# EAGLE design untitled (EAGLE 7.2.0)
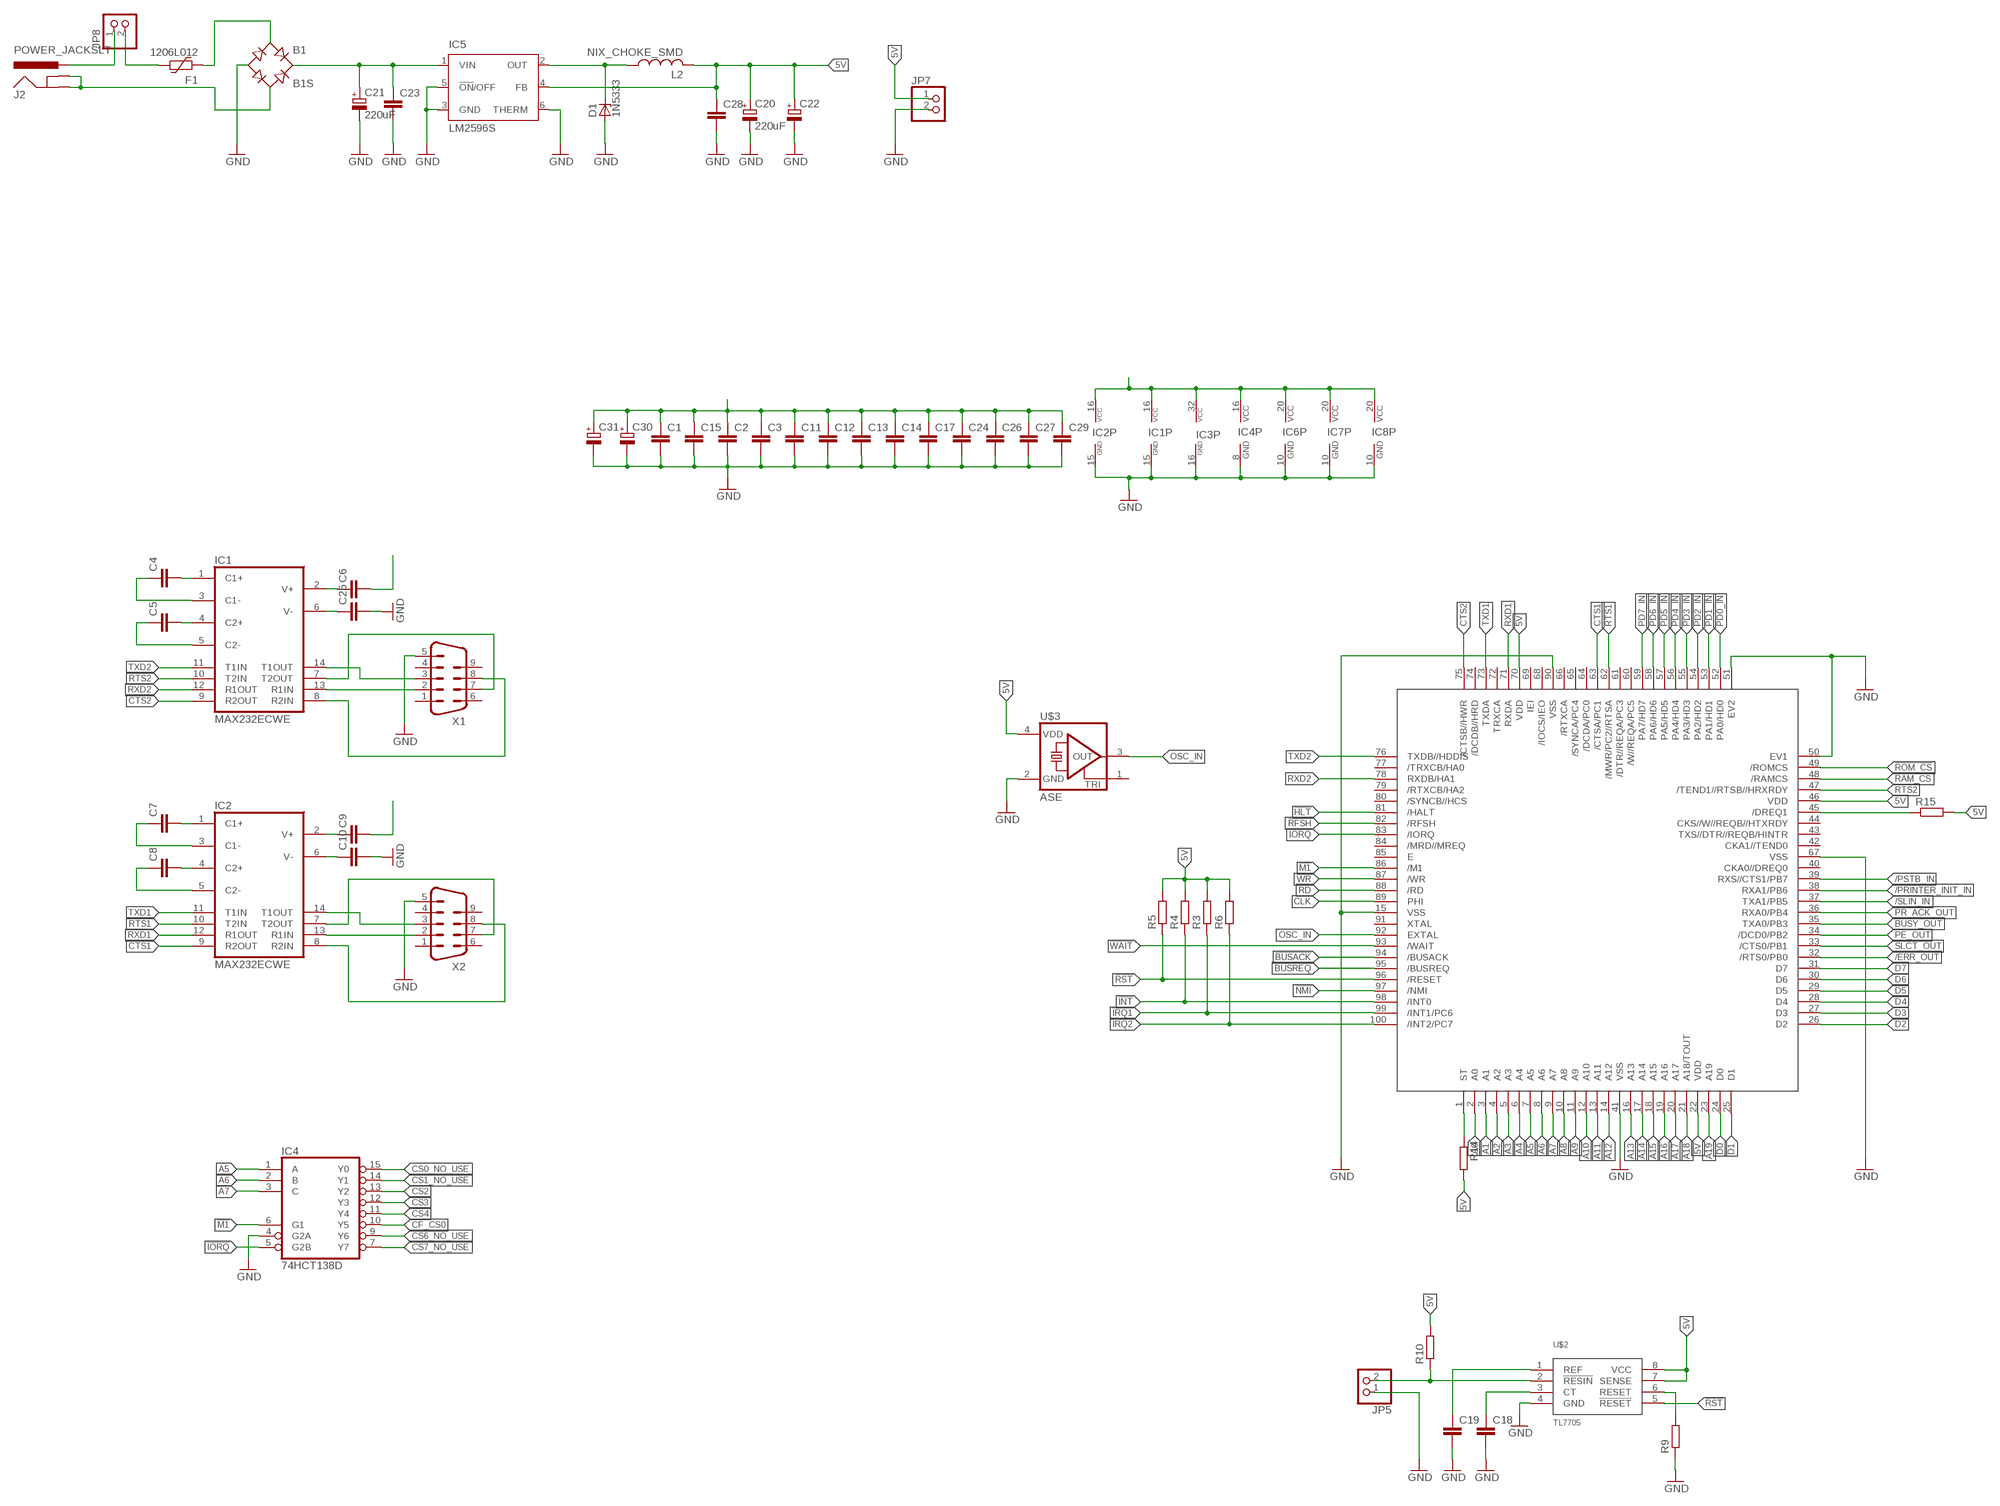
[diagram p0: schematic, sheet 1, part 1 of 2]
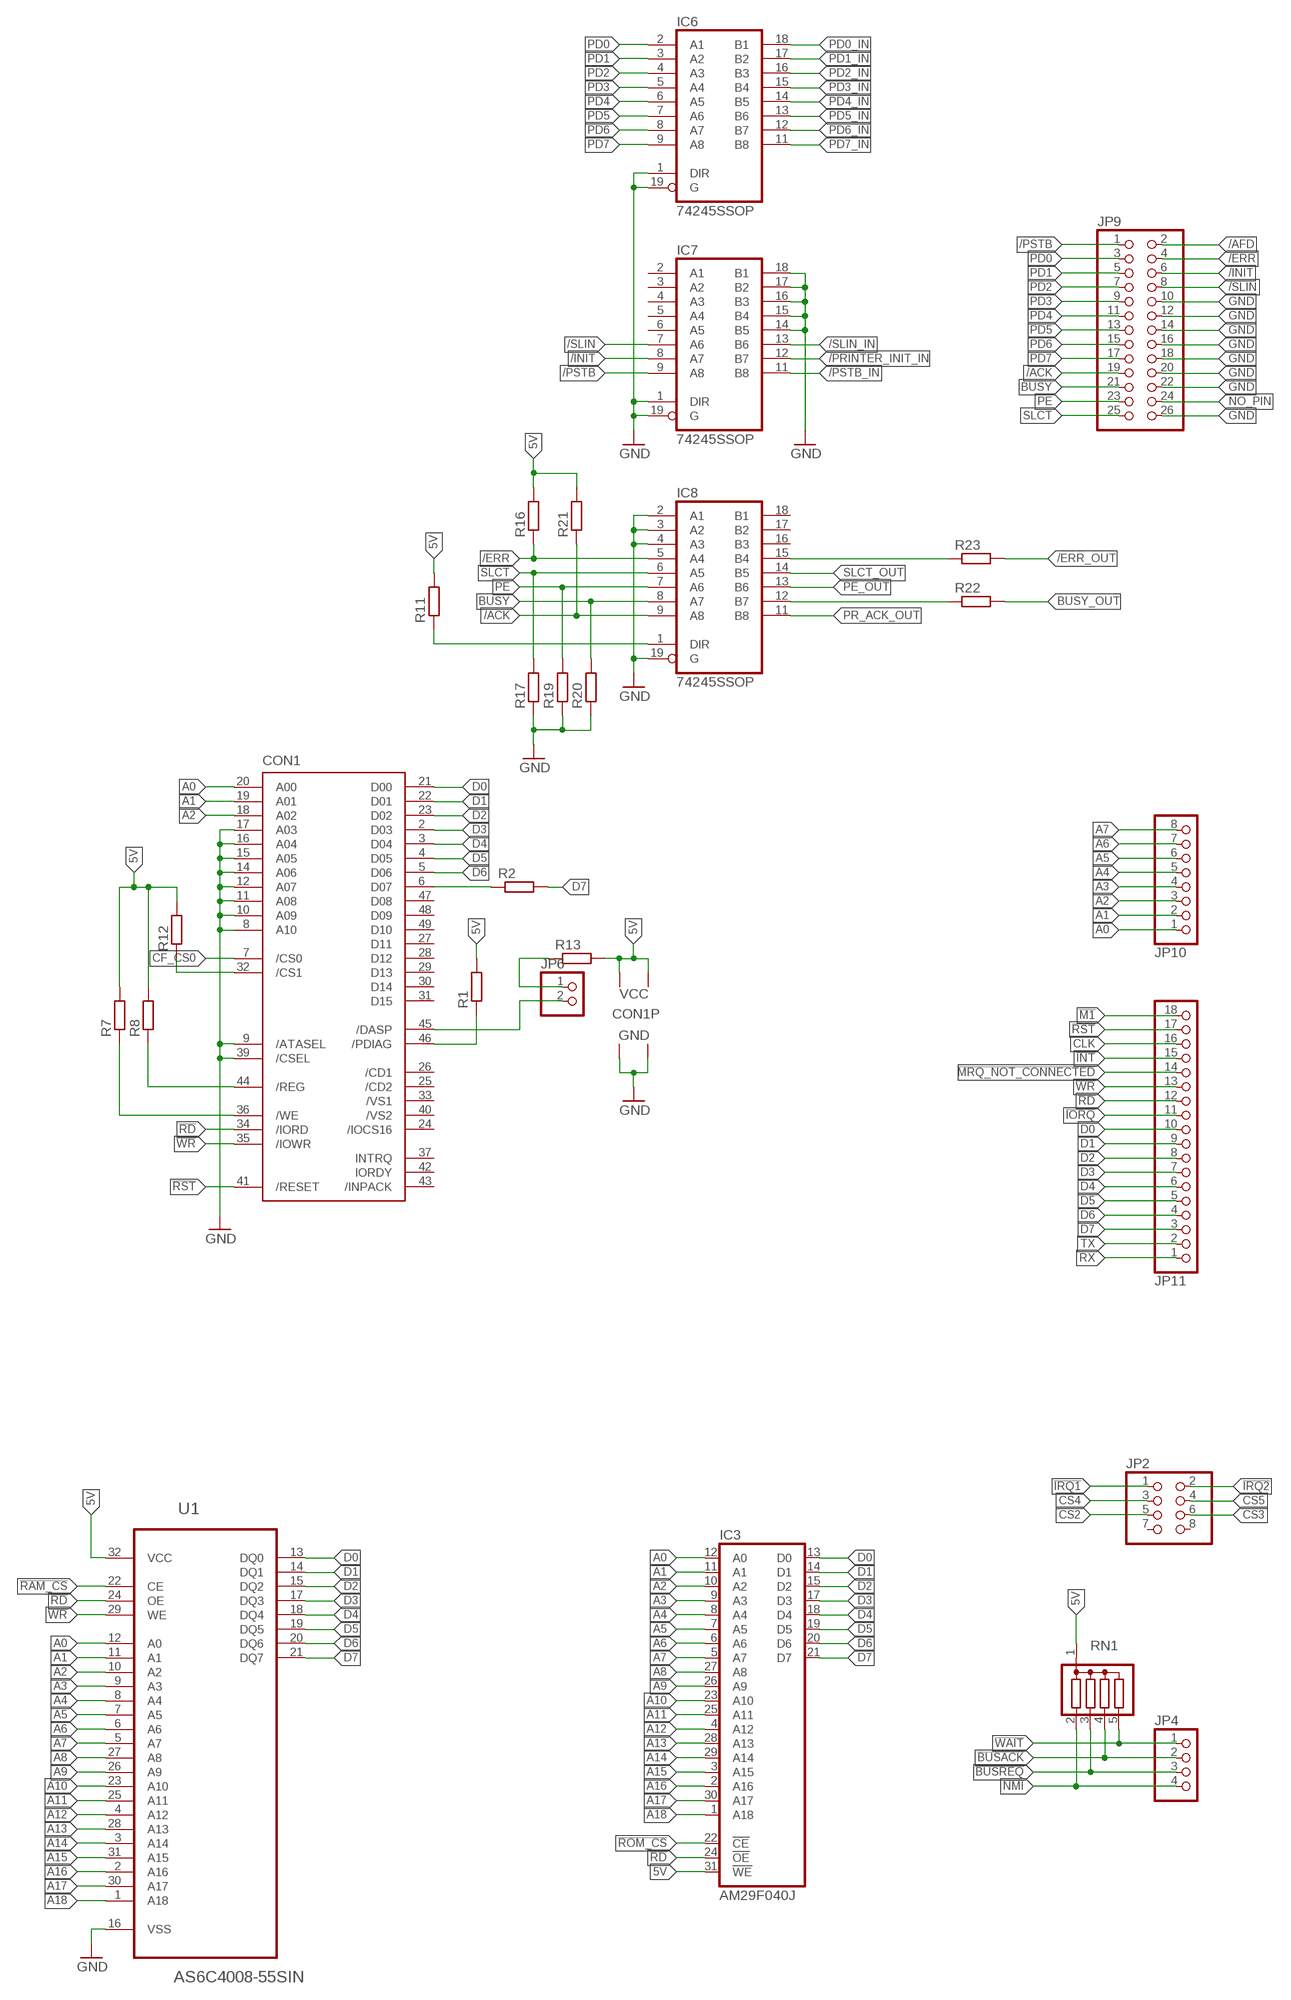
[diagram p1: schematic, sheet 1, part 2 of 2]

## Parts
B1  B1S  [MBS]
C1  C-EUC0603  [C0603]
C2  C-EUC0603  [C0603]
C3  C-EUC0402  [C0402]
C4  C-EUC0603  [C0603]
C5  C-EUC0603  [C0603]
C6  C-EUC0603  [C0603]
C7  C-EUC0603  [C0603]
C8  C-EUC0603  [C0603]
C9  C-EUC0603  [C0603]
C10  C-EUC0603  [C0603]
C11  C-EUC0603  [C0603]
C12  C-EUC0603  [C0603]
C13  C-EUC0402  [C0402]
C14  C-EUC0603  [C0603]
C15  C-EUC0603  [C0603]
C17  C-EUC0603  [C0603]
C18  C-EUC0603  [C0603]
C19  C-EUC0603  [C0603]
C20  220uF  CPOL-EU153CLV-0810  [153CLV-0810]
C21  220uF  CPOL-EU153CLV-0810  [153CLV-0810]
C22  CPOL-EUSMCC  [SMC_C]
C23  C-EUC0603  [C0603]
C24  C-EUC0603  [C0603]
C25  C-EUC0603  [C0603]
C26  C-EUC0402  [C0402]
C27  C-EUC0402  [C0402]
C28  C-EUC0603  [C0603]
C29  C-EUC0603  [C0603]
C30  CPOL-EUSMCB  [SMC_B]
C31  CPOL-EUSMCB  [SMC_B]
CON1  CF-CARD-IDE_MODE  [MI20-50PD-SF]
D1  1N5333  [C1702-15]
F1  1206L012  [1206L]
IC1  MAX232ECWE  [SO16L]
IC2  MAX232ECWE  [SO16L]
IC3  AM29F040J  [PLCC32R]
IC4  74HCT138D  [SO16]
IC5  LM2596S  [TO263-5]
IC6  74245SSOP  [SSOP20]
IC7  74245SSOP  [SSOP20]
IC8  74245SSOP  [SSOP20]
J2  POWER_JACKSLT  [POWER_JACK_SLOT]
JP2  PINHD-2X4  [2X04]
JP4  PINHD-1X4  [1X04]
JP5  PINHD-1X2  [1X02]
JP6  PINHD-1X2  [1X02]
JP7  PINHD-1X2  [1X02]
JP8  PINHD-1X2  [1X02]
JP9  PINHD-2X13_2.54-SMD  [2X13SMD]
JP10  PINHD-1X8  [1X08]
JP11  PINHD-1X18  [1X18]
L2  NIX_CHOKE_SMD  [NIX_CHOKE_SMD]
R1  R-EU_R0603  [R0603]
R2  R-EU_R0603  [R0603]
R3  R-EU_R0402  [R0402]
R4  R-EU_R0603  [R0603]
R5  R-EU_R1206  [R1206]
R6  R-EU_R0603  [R0603]
R7  R-EU_R0603  [R0603]
R8  R-EU_R0603  [R0603]
R9  R-EU_R0603  [R0603]
R10  R-EU_M1206  [M1206]
R11  R-EU_R0603  [R0603]
R12  R-EU_R0603  [R0603]
R13  R-EU_R0603  [R0603]
R14  R-EU_0204/5  [0204/5]
R15  R-EU_R0402  [R0402]
R16  R-EU_R0603  [R0603]
R17  R-EU_R0603  [R0603]
R19  R-EU_R0603  [R0603]
R20  R-EU_R0603  [R0603]
R21  R-EU_R0603  [R0603]
R22  R-EU_R0402  [R0402]
R23  R-EU_R0402  [R0402]
RN1  G04R  [SIL5]
U1  AS6C4008-55SIN  [SOIC127P1407X299-32N]
U$1  Z80182  [TQFP100]
U$2  TL7705  [SOIC8]
U$3  ASE  [ASE]
X1  M09HP  [M09HP]
X2  M09HP  [M09HP]

## Nets
5V: C1.1 C2.1 C3.1 C6.2 C9.2 C11.1 C12.1 C13.1 C14.1 C15.1 C17.1 C20.+ C22.+ C24.1 C26.1 C27.1 C28.1 C29.1 C30.+ C31.+ CON1.13(VCC2) CON1.38(VCC1) IC1.16(VCC) IC2.16(VCC) IC3.31(!WE) IC3.32(VCC) IC4.16(VCC) IC5.4(FB) IC6.20(VCC) IC7.20(VCC) IC8.20(VCC) JP7.1 L2.P$2 R1.2 R3.2 R4.2 R5.2 R6.2 R7.2 R8.2 R10.2 R11.2 R12.2 R13.2 R14.2 R15.2 R16.2 R21.2 RN1.1 U1.32(VCC) U$1.22(VDD) U$1.46(VDD) U$1.70(VDD) U$2.7(SENSE) U$2.8(VCC) U$3.4(VDD)
!BUSACK: JP4.2 RN1.4 U$1.94(/BUSACK)
!BUSREQ: JP4.3 RN1.3 U$1.95(/BUSREQ)
!HLT: U$1.81(/HALT)
!INT: JP11.15 R4.1 U$1.98(/INT0)
!IORQ: IC4.5(G2B) JP11.11 U$1.83(/IORQ)
!IRQ1: JP2.1 R3.1 U$1.99(/INT1/PC6)
!IRQ2: JP2.2 R6.1 U$1.100(/INT2/PC7)
!M1: IC4.6(G1) JP11.18 U$1.86(/M1)
!MRQ_NOT_CONNECTED: JP11.14
!NMI: JP4.4 RN1.2 U$1.97(/NMI)
!RAM_CS: U1.22(CE) U$1.48(/RAMCS)
!RD: CON1.34(/IORD) IC3.24(!OE) JP11.12 U1.24(OE) U$1.88(/RD)
!RFSH: U$1.82(/RFSH)
!ROM_CS: IC3.22(!CE) U$1.49(/ROMCS)
!RST: CON1.41(/RESET) JP11.17 R5.1 U$1.96(/RESET) U$2.5(!RESET)
!WAIT: JP4.1 RN1.5 U$1.93(/WAIT)
!WR: CON1.35(/IOWR) JP11.13 U1.29(WE) U$1.87(/WR)
/ACK: IC8.9(A8) JP9.19 R21.1
/AFD: JP9.2
/ERR: IC8.5(A4) JP9.4 R16.1
/ERR_OUT: R23.2 U$1.32(/RTS0/PB0)
/INIT: IC7.8(A7) JP9.6
/PRINTER_INIT_IN: IC7.12(B7) U$1.38(RXA1/PB6)
/PSTB: IC7.9(A8) JP9.1
/PSTB_IN: IC7.11(B8) U$1.39(RXS//CTS1/PB7)
/SLIN: IC7.7(A6) JP9.8
/SLIN_IN: IC7.13(B6) U$1.37(TXA1/PB5)
A0: CON1.20(A00) IC3.12(A0) JP10.1 U1.12(A0) U$1.2(A0)
A1: CON1.19(A01) IC3.11(A1) JP10.2 U1.11(A1) U$1.3(A1)
A2: CON1.18(A02) IC3.10(A2) JP10.3 U1.10(A2) U$1.4(A2)
A3: IC3.9(A3) JP10.4 U1.9(A3) U$1.5(A3)
A4: IC3.8(A4) JP10.5 U1.8(A4) U$1.6(A4)
A5: IC3.7(A5) IC4.1(A) JP10.6 U1.7(A5) U$1.7(A5)
A6: IC3.6(A6) IC4.2(B) JP10.7 U1.6(A6) U$1.8(A6)
A7: IC3.5(A7) IC4.3(C) JP10.8 U1.5(A7) U$1.9(A7)
A8: IC3.27(A8) U1.27(A8) U$1.10(A8)
A9: IC3.26(A9) U1.26(A9) U$1.11(A9)
A10: IC3.23(A10) U1.23(A10) U$1.12(A10)
A11: IC3.25(A11) U1.25(A11) U$1.13(A11)
A12: IC3.4(A12) U1.4(A12) U$1.14(A12)
A13: IC3.28(A13) U1.28(A13) U$1.16(A13)
A14: IC3.29(A14) U1.3(A14) U$1.17(A14)
A15: IC3.3(A15) U1.31(A15) U$1.18(A15)
A16: IC3.2(A16) U1.2(A16) U$1.19(A16)
A17: IC3.30(A17) U1.30(A17) U$1.20(A17)
A18: IC3.1(A18) U1.1(A18) U$1.21(A18/TOUT)
A19: U$1.23(A19)
BUSY: IC8.8(A7) JP9.21 R20.2
BUSY_OUT: R22.2 U$1.35(TXA0/PB3)
CF_CS0: CON1.7(/CS0) IC4.10(Y5)
CLK: JP11.16 U$1.89(PHI)
CS0_NO_USE: IC4.15(Y0)
CS1_NO_USE: IC4.14(Y1)
CS2: IC4.13(Y2) JP2.5
CS3: IC4.12(Y3) JP2.6
CS4: IC4.11(Y4) JP2.3
CS5: JP2.4
CS6_NO_USE: IC4.9(Y6)
CS7_NO_USE: IC4.7(Y7)
CTS1: IC2.9(R2OUT) U$1.63(/CTSA/PC1)
CTS2: IC1.9(R2OUT) U$1.75(/CTSB//HWR)
D0: CON1.21(D00) IC3.13(D0) JP11.10 U1.13(DQ0) U$1.24(D0)
D1: CON1.22(D01) IC3.14(D1) JP11.9 U1.14(DQ1) U$1.25(D1)
D2: CON1.23(D02) IC3.15(D2) JP11.8 U1.15(DQ2) U$1.26(D2)
D3: CON1.2(D03) IC3.17(D3) JP11.7 U1.17(DQ3) U$1.27(D3)
D4: CON1.3(D04) IC3.18(D4) JP11.6 U1.18(DQ4) U$1.28(D4)
D5: CON1.4(D05) IC3.19(D5) JP11.5 U1.19(DQ5) U$1.29(D5)
D6: CON1.5(D06) IC3.20(D6) JP11.4 U1.20(DQ6) U$1.30(D6)
D7: IC3.21(D7) JP11.3 R2.2 U1.21(DQ7) U$1.31(D7)
GND: B1.- C1.2 C2.2 C3.2 C10.2 C11.2 C12.2 C13.2 C14.2 C15.2 C17.2 C18.2 C19.2 C20.- C21.- C22.- C23.2 C24.2 C25.2 C26.2 C27.2 C28.2 C29.2 C30.- C31.- CON1.1(GND1) CON1.8(A10) CON1.9(/ATASEL) CON1.10(A09) CON1.11(A08) CON1.12(A07) CON1.14(A06) CON1.15(A05) CON1.16(A04) CON1.17(A03) CON1.39(/CSEL) CON1.50(GND2) D1.A IC1.15(GND) IC2.15(GND) IC3.16(GND) IC4.4(G2A) IC4.8(GND) IC5.3(GND) IC5.5(!ON!/OFF) IC5.6(THERM) IC6.1(DIR) IC6.10(GND) IC6.19(G) IC7.1(DIR) IC7.10(GND) IC7.14(B5) IC7.15(B4) IC7.16(B3) IC7.17(B2) IC7.18(B1) IC7.19(G) IC8.2(A1) IC8.3(A2) IC8.4(A3) IC8.10(GND) IC8.19(G) JP5.1 JP7.2 JP9.10 JP9.12 JP9.14 JP9.16 JP9.18 JP9.20 JP9.22 JP9.26 R9.1 R17.1 R19.1 R20.1 U1.16(VSS) U$1.15(VSS) U$1.41(VSS) U$1.50(EV1) U$1.51(EV2) U$1.67(VSS) U$1.90(VSS) U$2.4(GND) U$3.2(GND) X1.5 X2.5
N$1: IC2.7(T2OUT) X2.7
N$2: C7.2 IC2.1(C1+)
N$3: C8.2 IC2.4(C2+)
N$4: C8.1 IC2.5(C2-)
N$5: C7.1 IC2.3(C1-)
N$6: C9.1 IC2.2(V+)
N$7: IC1.7(T2OUT) X1.7
N$8: IC1.13(R1IN) X1.2
N$9: C4.2 IC1.1(C1+)
N$10: C5.2 IC1.4(C2+)
N$11: C5.1 IC1.5(C2-)
N$12: C4.1 IC1.3(C1-)
N$13: C6.1 IC1.2(V+)
N$14: C25.1 IC1.6(V-)
N$15: IC2.13(R1IN) X2.2
N$16: IC2.14(T1OUT) X2.3
N$17: IC2.8(R2IN) X2.8
N$18: IC1.14(T1OUT) X1.3
N$19: C10.1 IC2.6(V-)
N$20: J2.PWR JP8.1
N$21: B1.AC1 F1.2
N$22: B1.+ C21.+ C23.1 IC5.1(VIN)
N$23: D1.C IC5.2(OUT) L2.P$1
N$24: B1.AC2 J2.GND@1(GNDBREAK) J2.GND@2(GND)
N$25: R15.1 U$1.45(/DREQ1)
N$26: IC8.1(DIR) R11.1
N$27: CON1.44(/REG) R8.1
N$28: IC1.8(R2IN) X1.8
N$29: CON1.36(/WE) R7.1
N$30: CON1.46(/PDIAG) R1.1
N$31: CON1.32(/CS1) R12.1
N$32: JP6.1 R13.1
N$33: CON1.45(/DASP) JP6.2
N$34: CON1.6(D07) R2.1
N$35: R9.2 U$2.6(RESET)
N$36: C18.1 U$2.3(CT)
N$37: C19.1 U$2.1(REF)
N$38: JP5.2 R10.1 U$2.2(!RESIN)
N$39: F1.1 JP8.2
N$46: IC8.12(B7) R22.1
N$47: IC8.15(B4) R23.1
NO_PIN: JP9.24
OSC_IN: U$1.92(EXTAL) U$3.3(OUT)
PD0: IC6.2(A1) JP9.3
PD0_IN: IC6.18(B1) U$1.52(PA0/HD0)
PD1: IC6.3(A2) JP9.5
PD1_IN: IC6.17(B2) U$1.53(PA1/HD1)
PD2: IC6.4(A3) JP9.7
PD2_IN: IC6.16(B3) U$1.54(PA2/HD2)
PD3: IC6.5(A4) JP9.9
PD3_IN: IC6.15(B4) U$1.55(PA3/HD3)
PD4: IC6.6(A5) JP9.11
PD4_IN: IC6.14(B5) U$1.56(PA4/HD4)
PD5: IC6.7(A6) JP9.13
PD5_IN: IC6.13(B6) U$1.57(PA5/HD5)
PD6: IC6.8(A7) JP9.15
PD6_IN: IC6.12(B7) U$1.58(PA6/HD6)
PD7: IC6.9(A8) JP9.17
PD7_IN: IC6.11(B8) U$1.59(PA7/HD7)
PE: IC8.7(A6) JP9.23 R19.2
PE_OUT: IC8.13(B6) U$1.34(/DCD0/PB2)
PR_ACK_OUT: IC8.11(B8) U$1.36(RXA0/PB4)
RTS1: IC2.10(T2IN) U$1.62(/MWR/PC2//RTSA)
RTS2: IC1.10(T2IN) U$1.47(/TEND1//RTSB//HRXRDY)
RX: JP11.1
RXD1: IC2.12(R1OUT) U$1.71(RXDA)
RXD2: IC1.12(R1OUT) U$1.78(RXDB/HA1)
SLCT: IC8.6(A5) JP9.25 R17.2
SLCT_OUT: IC8.14(B5) U$1.33(/CTS0/PB1)
ST: R14.1 U$1.1(ST)
TX: JP11.2
TXD1: IC2.11(T1IN) U$1.73(TXDA)
TXD2: IC1.11(T1IN) U$1.76(TXDB//HDDIS)
Unconnected: CON1.24(/IOCS16) CON1.25(/CD2) CON1.26(/CD1) CON1.27(D11) CON1.28(D12) CON1.29(D13) CON1.30(D14) CON1.31(D15) CON1.33(/VS1) CON1.37(INTRQ) CON1.40(/VS2) CON1.42(IORDY) CON1.43(/INPACK) CON1.47(D08) CON1.48(D09) CON1.49(D10) IC7.2(A1) IC7.3(A2) IC7.4(A3) IC7.5(A4) IC7.6(A5) IC8.16(B3) IC8.17(B2) IC8.18(B1) JP2.7 JP2.8 U$1.40(CKA0//DREQ0) U$1.42(CKA1//TEND0) U$1.43(TXS//DTR//REQB/HINTR) U$1.44(CKS//W//REQB//HTXRDY) U$1.60(/W//REQA/PC5) U$1.61(/DTR//REQA/PC3) U$1.64(/DCDA/PC0) U$1.65(/SYNCA/PC4) U$1.66(/RTXCA) U$1.68(/IOCS/IEO) U$1.69(IEI) U$1.72(TRXCA) U$1.74(/DCDB//HRD) U$1.77(/TRXCB/HA0) U$1.79(/RTXCB/HA2) U$1.80(/SYNCB//HCS) U$1.84(/MRD//MREQ) U$1.85(E) U$1.91(XTAL) U$3.1(TRI) X1.1 X1.4 X1.6 X1.9 X2.1 X2.4 X2.6 X2.9

## Library data of the parts
B1 = rectifier:B*S: Surface Mount Glass Passivated Bridge Rectifiers Source: Comchip Bridge Rectifiers B05S-G_B10S-G.pdf
C1-C15 C17-C19 C23-C29 = rcl:C-EU: CAPACITOR, European symbol
C20-C22 C30 C31 = rcl:CPOL-EU: POLARIZED CAPACITOR, European symbol
CON1 = con-hirose:CF-CARD-IDE_MODE: Compact Flash Adapter Type I or II without Eject Button Source: con-hirose.lbr from Bob Starr <rtzaudio@mindspring.com>; OC_FARNELL: unknown; OC_NEWARK: unknown
D1 = diode:1N5333: Z DIODE 3.3 V, 5W, 5 percent (Motorola)
F1 = polyfuse-smd_10:?: Polyfuse Resettable PTC Source: http://www.littelfuse.com/products/resettable-ptcs.aspx; MF: Littelfuse; MPN: 1206L012; OC_FARNELL: 1596988; OC_NEWARK: 05M2298
IC1 IC2 = maxim:MAX232ECWE: RS232 TRANSCEIVER; MF: MAXIM; MPN: MAX232ECWE+; OC_FARNELL: 9724435; OC_NEWARK: 67K4440
IC3 = am29-memory:AM29F040J: 4-Megabit FLASH MEMORY (512 K x 8 bit) 5 V-only
IC4 = 74xx-eu:74*138: 3-line to 8-line DECODER/DEMULTIPLEXER
IC5 = mw:LM2596: SIMPLE SWITCHER® Power Converter 150 kHz 3A Step-Down Voltage Regulator Source: http://www.national.com/ds/LM/LM2596.pdf; MF: NATIONAL SEMICONDUCTOR; MPN: LM2596S-ADJ/NOPB; OC_FARNELL: 9494367; OC_NEWARK: 41K3842
IC6-IC8 = 74xx-eu:74*245: Octal BUS TRANSCEIVER, 3-state
J2 = SparkFun-Connectors:POWER_JACK: Power Jack This is the standard 5.5mm barrel jack for power. The PTH is the most common, proven, reliable, footprint. The Slot footprint only works if the mill layer is transmitted to the PCB fab house so be warned. Mating wall wart : TOL-00298 (and others); PROD_ID: PRT-00119
JP2 = pinhead:PINHD-2X4: PIN HEADER
JP4 = pinhead:PINHD-1X4: PIN HEADER
JP5-JP8 = pinhead:PINHD-1X2: PIN HEADER
JP9 = pinhead-2:PINHD-2X13: PIN HEADER
JP10 = pinhead:PINHD-1X8: PIN HEADER
JP11 = pinhead:PINHD-1X18: PIN HEADER
L2 = mw:NIX_CHOKE_SMD
R1-R17 R19-R23 = rcl:R-EU_: RESISTOR, European symbol
RN1 = resistor-sil:G04R: SIL RESISTOR; OC_FARNELL: unknown; OC_NEWARK: unknown
U1 = Alliance_Memory_By_element14_Batch_1:AS6C4008-55SIN: CMOS SRAM; MPN: AS6C4008-55SIN; OC_FARNELL: 1562901; OC_NEWARK: 94M6218; PACKAGE: SO-32; SUPPLIER: ALLIANCE MEMORY
U$1 = mw:Z80182
U$2 = mw:TL7705
U$3 = crystal:ASE: 3.3Vdc CMOS SMD CRYSTAL CLOCK OSCILLATOR SOurce: www.abracon.com; OC_FARNELL: unknown; OC_NEWARK: unknown
X1 X2 = con-subd:M09: SUB-D; OC_FARNELL: unknown; OC_NEWARK: unknown

## Board
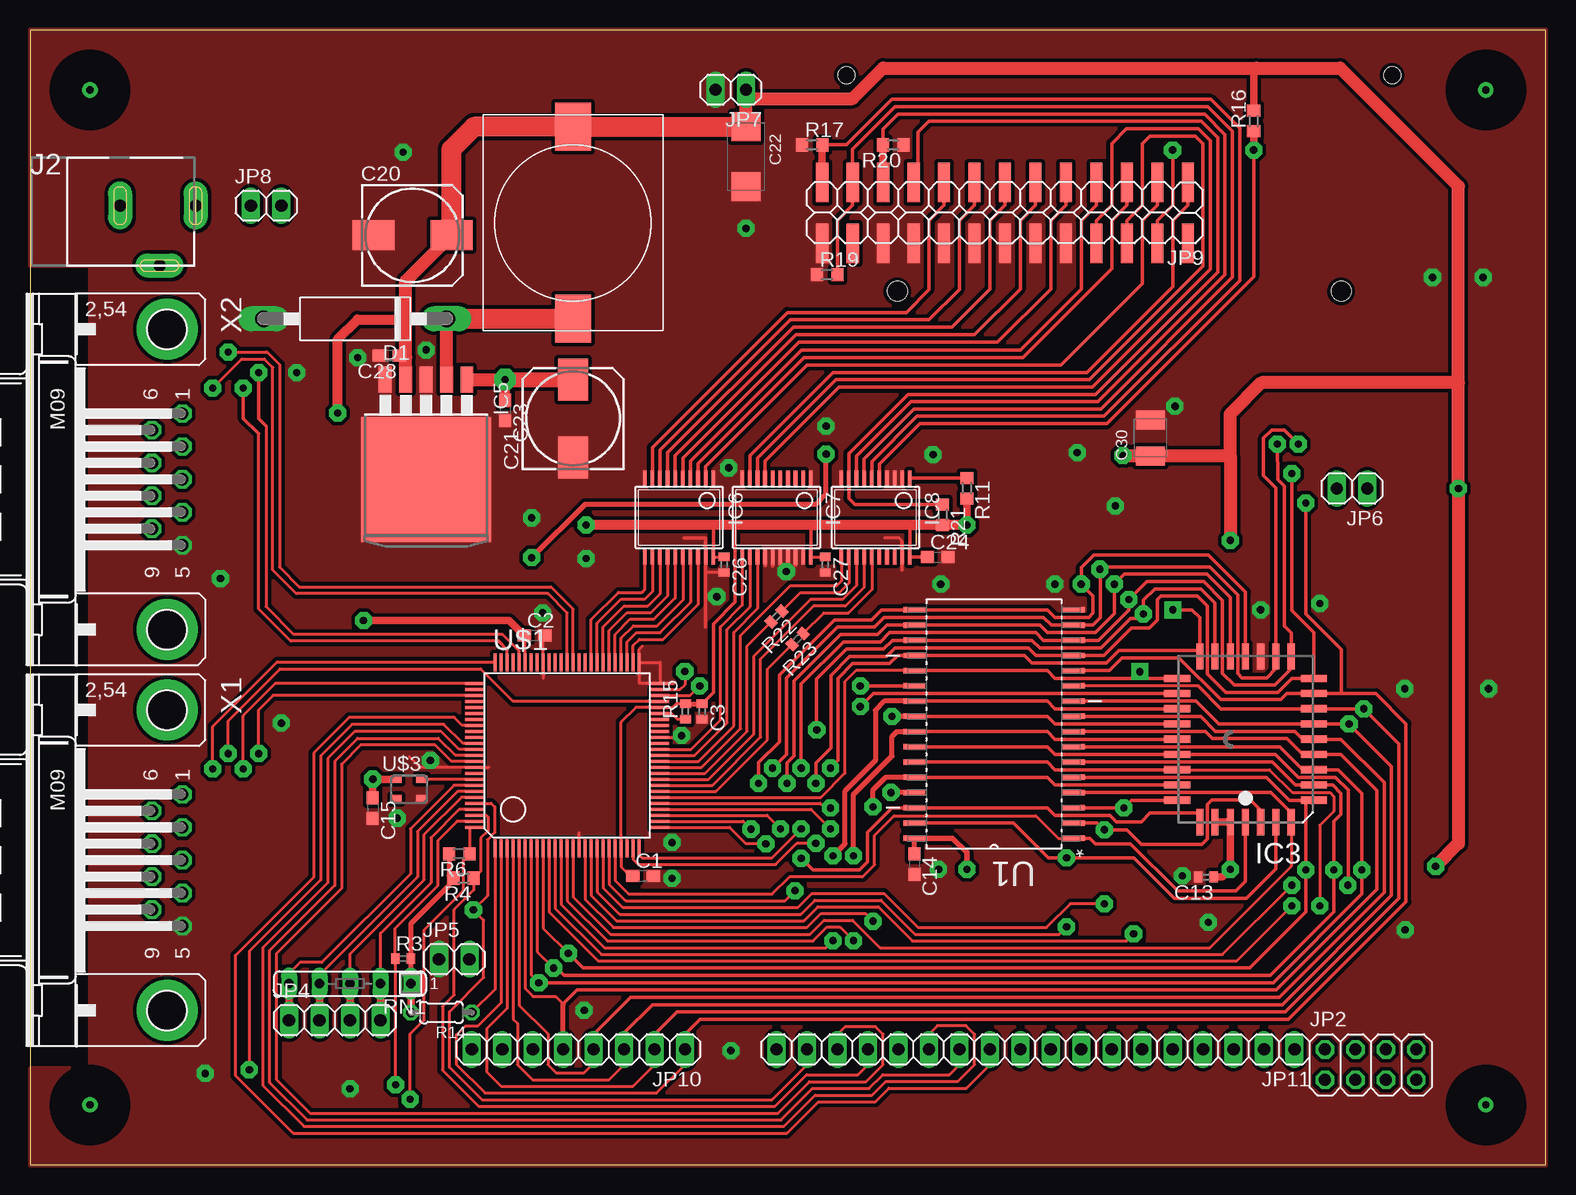
[diagram p2: board, top side]
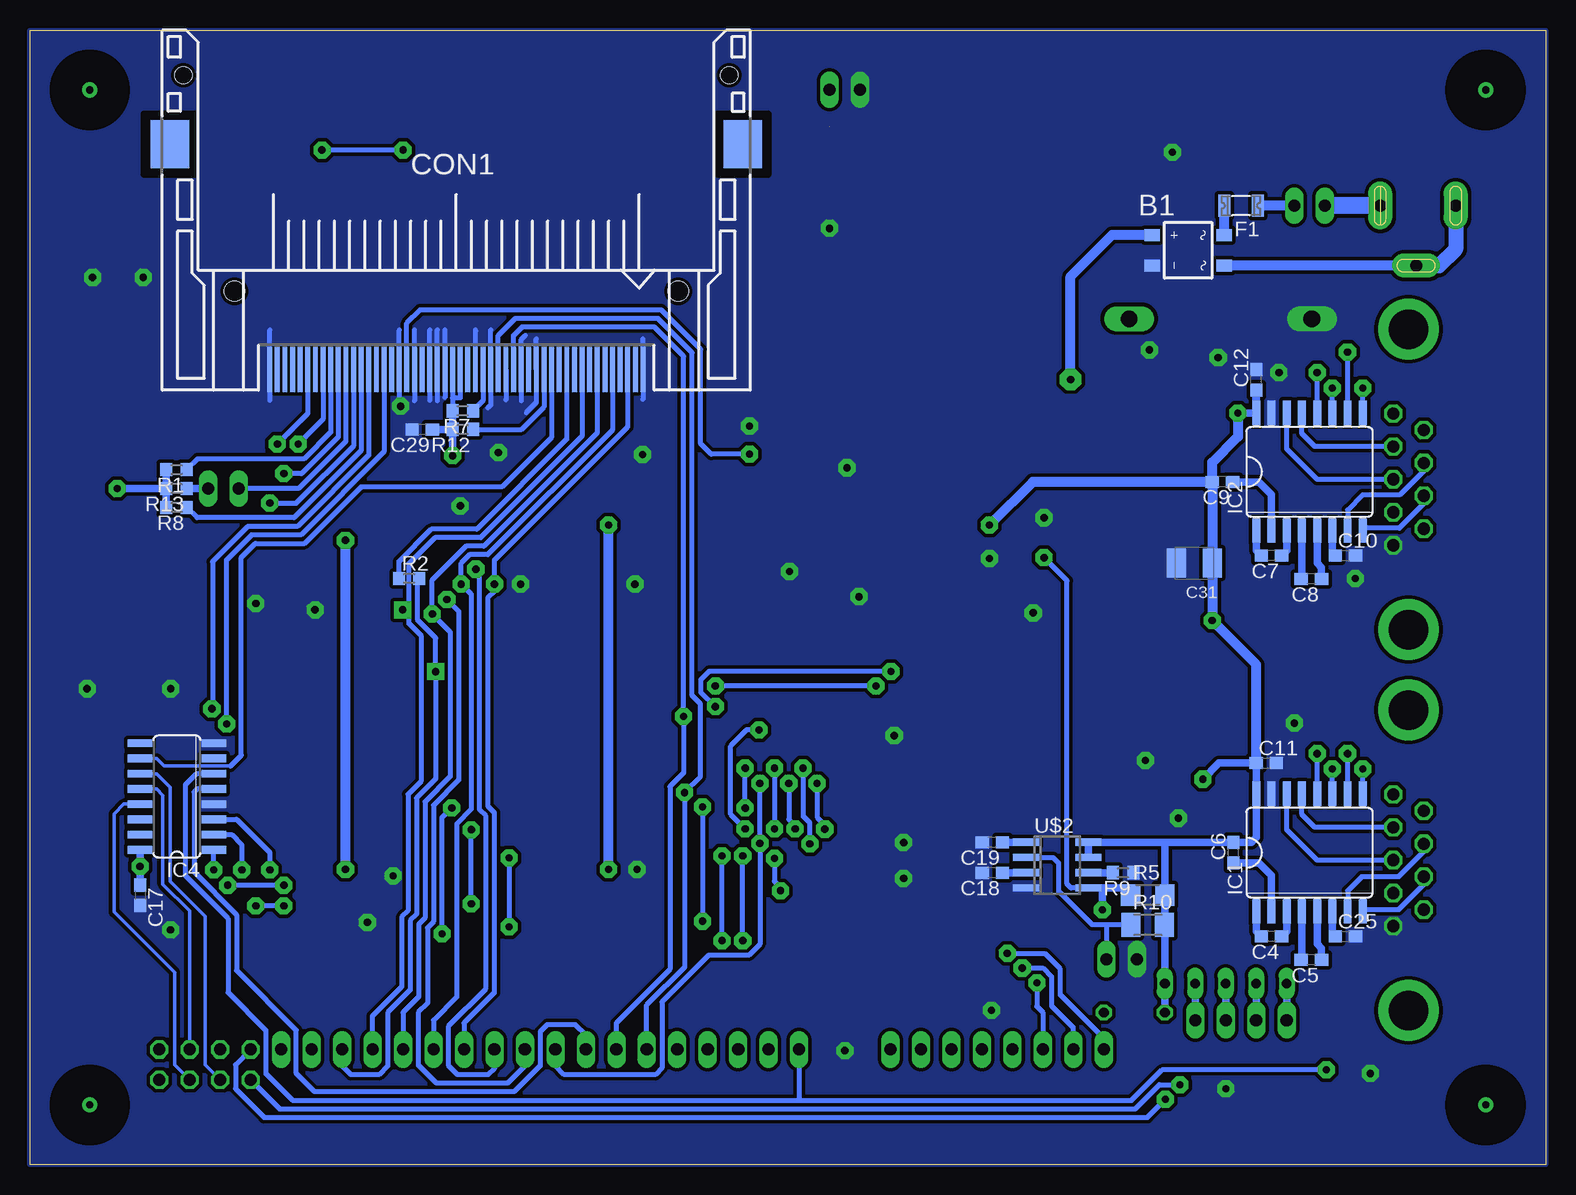
[diagram p3: board, bottom side, seen from below]

Size 126.34 x 94.61 mm. Coordinates in mm from the lower left corner, seen from the top.
Outline: 0,0 126.34,0 126.34,94.61 0,94.61 0,0
Copper layers (1*16): Top 0.035mm / dielectric 1.5mm / Bottom 0.035mm
Design rules "default *": minimum track width 10mil, minimum drill 24mil, track to track 8mil, track to pad 8mil, pad to pad 8mil, via to via 8mil, smd to smd 8mil, copper to edge 0mil, drill to drill 8mil, minimum pad ring 10mil, minimum via ring 8mil, stop-mask expansion 4mil, vias tented up to drill 0mil, thermal gap 10mil
tRestrict: area 2,2 to 8,8; area 118.3,2 to 124.4,8; area 2,86.6 to 8,92.7; area 118.3,86.6 to 124.4,92.7; area 51.8,28 to 52.4,37.7
bRestrict: area 75.7,64.4 to 105.9,68.2; area 2,2 to 8,8; area 118.3,2 to 124.4,8; area 2,86.6 to 8,92.7; area 118.3,86.6 to 124.4,92.7

### Footprints (pad centres in the part's own frame; a part is rotated, then mirrored left to right if it is on the bottom)
MBS = smd 1 x 1.3: + -1.27,-3; - 1.27,-3; AC1 -1.27,3; AC2 1.27,3
C0603 = smd 1.1 x 1: 1 -0.85,0; 2 0.85,0
C0402 = smd 0.7 x 0.9: 1 -0.65,0; 2 0.65,0
153CLV-0810 = smd 3.5 x 2.5: + 3.25,0; - -3.25,0
SMC_C = smd 2.4 x 2.4: + -2.5,0; - 2.5,0
SMC_B = smd 1.6 x 2.4: + -1.5,0; - 1.5,0
MI20-50PD-SF = smd 0.41 x 3.75: 1 15.557,-18.78; 2 14.287,-18.78; 3 13.018,-18.78; 4 11.748,-18.78; 5 10.477,-18.78; 6 9.207,-18.78; 7 7.938,-18.78; 8 6.668,-18.78; 9 5.397,-18.78; 10 4.128,-18.78; 11 2.857,-18.78; 12 1.587,-18.78; 13 0.318,-18.78; 14 -0.953,-18.78; 15 -2.223,-18.78; 16 -3.493,-18.78; 17 -4.763,-18.78; 18 -6.032,-18.78; 19 -7.303,-18.78; 20 -8.572,-18.78; 21 -9.842,-18.78; 22 -11.113,-18.78; 23 -12.383,-18.78; 24 -13.652,-18.78; 25 -14.922,-18.78; 26 14.922,-18.78; 27 13.652,-18.78; 28 12.383,-18.78; 29 11.113,-18.78; 30 9.842,-18.78; 31 8.572,-18.78; 32 7.303,-18.78; 33 6.032,-18.78; 34 4.763,-18.78; 35 3.493,-18.78; 36 2.223,-18.78; 37 0.953,-18.78; 38 -0.318,-18.78; 39 -1.587,-18.78; 40 -2.857,-18.78; 41 -4.128,-18.78; 42 -5.397,-18.78; 43 -6.668,-18.78; 44 -7.938,-18.78; 45 -9.207,-18.78; 46 -10.477,-18.78; 47 -11.748,-18.78; 48 -13.018,-18.78; 49 -14.287,-18.78; 50 -15.557,-18.78 | smd 3.2 x 4: M1 -23.883,-0.005; M2 23.883,-0.005 | hole 1.676: 18.5,-12.25; -18.5,-12.25 | hole 1.422: -22.75,5.75; 22.75,5.75
C1702-15 = drill 1.397 long: A 7.62,0; C -7.62,0
1206L = smd 1 x 1.8: 1 -1.4,0; 2 1.4,0
SO16L = smd 0.66 x 2.032: 1 -4.445,-4.902; 2 -3.175,-4.902; 3 -1.905,-4.902; 4 -0.635,-4.902; 5 0.635,-4.902; 6 1.905,-4.902; 7 3.175,-4.902; 8 4.445,-4.902; 9 4.445,4.902; 10 3.175,4.902; 11 1.905,4.902; 12 0.635,4.902; 13 -0.635,4.902; 14 -1.905,4.902; 15 -3.175,4.902; 16 -4.445,4.902
PLCC32R = smd 0.6 x 2.2: 1 0,6.9; 2 -1.27,6.9; 3 -2.54,6.9; 4 -3.81,6.9; 14 -3.81,-6.9; 15 -2.54,-6.9; 16 -1.27,-6.9; 17 0,-6.9; 18 1.27,-6.9; 19 2.54,-6.9; 20 3.81,-6.9; 30 3.81,6.9; 31 2.54,6.9; 32 1.27,6.9 | smd 2.2 x 0.6: 5 -5.7,5.08; 6 -5.7,3.81; 7 -5.7,2.54; 8 -5.7,1.27; 9 -5.7,0; 10 -5.7,-1.27; 11 -5.7,-2.54; 12 -5.7,-3.81; 13 -5.7,-5.08; 21 5.7,-5.08; 22 5.7,-3.81; 23 5.7,-2.54; 24 5.7,-1.27; 25 5.7,0; 26 5.7,1.27; 27 5.7,2.54; 28 5.7,3.81; 29 5.7,5.08
SO16 = smd 0.66 x 2.032: 1 -4.445,-3.073; 2 -3.175,-3.073; 3 -1.905,-3.073; 4 -0.635,-3.073; 5 0.635,-3.073; 6 1.905,-3.073; 7 3.175,-3.073; 8 4.445,-3.073; 9 4.445,3.073; 10 3.175,3.073; 11 1.905,3.073; 12 0.635,3.073; 13 -0.635,3.073; 14 -1.905,3.073; 15 -3.175,3.073; 16 -4.445,3.073
TO263-5 = smd 1.067 x 2.159: 1 -3.404,-5.791; 2 -1.702,-5.791; 3 0,-5.791; 4 1.702,-5.791; 5 3.404,-5.791 | smd 10.8 x 10.41: 6 0,2.54
SSOP20 = smd 0.305 x 1.245: 1 -2.857,-3.302; 2 -2.222,-3.302; 3 -1.587,-3.302; 4 -0.952,-3.302; 5 -0.317,-3.302; 6 0.318,-3.302; 7 0.953,-3.302; 8 1.588,-3.302; 9 2.223,-3.302; 10 2.858,-3.302; 11 2.858,3.302; 12 2.223,3.302; 13 1.588,3.302; 14 0.953,3.302; 15 0.318,3.302; 16 -0.317,3.302; 17 -0.952,3.302; 18 -1.587,3.302; 19 -2.222,3.302; 20 -2.857,3.302
POWER_JACK_SLOT = drill 1 pad 2 long: GND@1 2.58,7.5; GND@2 7.58,10.8; PWR 2.58,13.8
2X04 = drill 1.016 octagon: 1 -3.81,-1.27; 2 -3.81,1.27; 3 -1.27,-1.27; 4 -1.27,1.27; 5 1.27,-1.27; 6 1.27,1.27; 7 3.81,-1.27; 8 3.81,1.27
1X04 = drill 1.016 long: 1 -3.81,0; 2 -1.27,0; 3 1.27,0; 4 3.81,0
1X02 = drill 1.016 long: 1 -1.27,0; 2 1.27,0
2X13SMD = smd 1.016 x 3.302: 1 -1.27,-3.81; 2 -1.27,1.27; 3 1.27,-3.81; 4 1.27,1.27; 5 3.81,-3.81; 6 3.81,1.27; 7 6.35,-3.81; 8 6.35,1.27; 9 8.89,-3.81; 10 8.89,1.27; 11 11.43,-3.81; 12 11.43,1.27; 13 13.97,-3.81; 14 13.97,1.27; 15 16.51,-3.81; 16 16.51,1.27; 17 19.05,-3.81; 18 19.05,1.27; 19 21.59,-3.81; 20 21.59,1.27; 21 24.13,-3.81; 22 24.13,1.27; 23 26.67,-3.81; 24 26.67,1.27; 25 29.21,-3.81; 26 29.21,1.27
1X08 = drill 1.016 long: 1 -8.89,0; 2 -6.35,0; 3 -3.81,0; 4 -1.27,0; 5 1.27,0; 6 3.81,0; 7 6.35,0; 8 8.89,0
1X18 = drill 1.016 long: 1 -21.59,0; 2 -19.05,0; 3 -16.51,0; 4 -13.97,0; 5 -11.43,0; 6 -8.89,0; 7 -6.35,0; 8 -3.81,0; 9 -1.27,0; 10 1.27,0; 11 3.81,0; 12 6.35,0; 13 8.89,0; 14 11.43,0; 15 13.97,0; 16 16.51,0; 17 19.05,0; 18 21.59,0
NIX_CHOKE_SMD = smd 4 x 3: P$1 1,7.5; P$2 17,7.5
R0603 = smd 1 x 1.1: 1 -0.85,0; 2 0.85,0
R0402 = smd 0.7 x 0.9: 1 -0.65,0; 2 0.65,0
R1206 = smd 1.6 x 1.803: 1 -1.422,0; 2 1.422,0
M1206 = smd 1.6 x 2: 1 -1.4,0; 2 1.4,0
0204/5 = drill 0.813 octagon: 1 -2.54,0; 2 2.54,0
SIL5 = drill 0.813 long: 1 -5.08,0; 2 -2.54,0; 3 0,0; 4 2.54,0; 5 5.08,0
SOIC127P1407X299-32N = smd 1.803 x 0.457: 1 -6.655,9.525; 2 -6.655,8.255; 3 -6.655,6.985; 4 -6.655,5.715; 5 -6.655,4.445; 6 -6.655,3.175; 7 -6.655,1.905; 8 -6.655,0.635; 9 -6.655,-0.635; 10 -6.655,-1.905; 11 -6.655,-3.175; 12 -6.655,-4.445; 13 -6.655,-5.715; 14 -6.655,-6.985; 15 -6.655,-8.255; 16 -6.655,-9.525; 17 6.655,-9.525; 18 6.655,-8.255; 19 6.655,-6.985; 20 6.655,-5.715; 21 6.655,-4.445; 22 6.655,-3.175; 23 6.655,-1.905; 24 6.655,-0.635; 25 6.655,0.635; 26 6.655,1.905; 27 6.655,3.175; 28 6.655,4.445; 29 6.655,5.715; 30 6.655,6.985; 31 6.655,8.255; 32 6.655,9.525
TQFP100 = smd 0.27 x 1.5: 1 -6,-7.75; 2 -5.5,-7.75; 3 -5,-7.75; 4 -4.5,-7.75; 5 -4,-7.75; 6 -3.5,-7.75; 7 -3,-7.75; 8 -2.5,-7.75; 9 -2,-7.75; 10 -1.5,-7.75; 11 -1,-7.75; 12 -0.5,-7.75; 13 0,-7.75; 14 0.5,-7.75; 15 1,-7.75; 16 1.5,-7.75; 17 2,-7.75; 18 2.5,-7.75; 19 3,-7.75; 20 3.5,-7.75; 21 4,-7.75; 22 4.5,-7.75; 23 5,-7.75; 24 5.5,-7.75; 25 6,-7.75; 51 6,7.75; 52 5.5,7.75; 53 5,7.75; 54 4.5,7.75; 55 4,7.75; 56 3.5,7.75; 57 3,7.75; 58 2.5,7.75; 59 2,7.75; 60 1.5,7.75; 61 1,7.75; 62 0.5,7.75; 63 0,7.75; 64 -0.5,7.75; 65 -1,7.75; 66 -1.5,7.75; 67 -2,7.75; 68 -2.5,7.75; 69 -3,7.75; 70 -3.5,7.75; 71 -4,7.75; 72 -4.5,7.75; 73 -5,7.75; 74 -5.5,7.75; 75 -6,7.75 | smd 1.5 x 0.27: 26 7.75,-6; 27 7.75,-5.5; 28 7.75,-5; 29 7.75,-4.5; 30 7.75,-4; 31 7.75,-3.5; 32 7.75,-3; 33 7.75,-2.5; 34 7.75,-2; 35 7.75,-1.5; 36 7.75,-1; 37 7.75,-0.5; 38 7.75,0; 39 7.75,0.5; 40 7.75,1; 41 7.75,1.5; 42 7.75,2; 43 7.75,2.5; 44 7.75,3; 45 7.75,3.5; 46 7.75,4; 47 7.75,4.5; 48 7.75,5; 49 7.75,5.5; 50 7.75,6; 76 -7.75,6; 77 -7.75,5.5; 78 -7.75,5; 79 -7.75,4.5; 80 -7.75,4; 81 -7.75,3.5; 82 -7.75,3; 83 -7.75,2.5; 84 -7.75,2; 85 -7.75,1.5; 86 -7.75,1; 87 -7.75,0.5; 88 -7.75,0; 89 -7.75,-0.5; 90 -7.75,-1; 91 -7.75,-1.5; 92 -7.75,-2; 93 -7.75,-2.5; 94 -7.75,-3; 95 -7.75,-3.5; 96 -7.75,-4; 97 -7.75,-4.5; 98 -7.75,-5; 99 -7.75,-5.5; 100 -7.75,-6
SOIC8 = smd 0.6 x 2.2: 1 -1.905,-2.6; 2 -0.635,-2.6; 3 0.635,-2.6; 4 1.905,-2.6; 5 1.905,2.6; 6 0.635,2.6; 7 -0.635,2.6; 8 -1.905,2.6
ASE = smd 0.9 x 0.65: 1 -1.05,-0.825; 2 1.05,-0.825; 3 1.05,0.825; 4 -1.05,0.825
M09HP = drill 1.016 octagon: 1 -5.486,1.27; 2 -2.743,1.27; 3 0,1.27; 4 2.743,1.27; 5 5.486,1.27; 6 -4.115,-1.27; 7 -1.372,-1.27; 8 1.372,-1.27; 9 4.115,-1.27 | drill 3.302 pad 5.08: G1 -12.522,0; G2 12.522,0

### Placement (x,y rotation side)
B1  29.8,76.25 270 bottom
C1  51.1,24.1 0 top
C2  42.06,44.15 0 top
C3  56.03,37.8 270 top
C4  22.86,19.05 180 bottom
C5  19.53,17.09 180 bottom
C6  26.04,26.04 90 bottom
C7  22.86,50.8 180 bottom
C8  19.53,48.84 180 bottom
C9  26.95,56.95 180 bottom
C10  16.69,50.8 0 bottom
C11  23.29,33.5 0 bottom
C12  24.13,65.46 90 bottom
C13  98.03,24 180 top
C14  73.71,25.07 270 top
C15  28.57,29.74 270 top
C17  117.17,22.48 270 bottom
C18  46.13,24.36 180 bottom
C19  46.13,26.9 180 bottom
C20  31.88,77.5 0 top
C21  45.26,62.23 90 top
C22  59.69,84.05 270 top
C23  39.6,62.89 270 top
C24  75.67,50.67 0 top
C25  16.69,19.05 0 bottom
C26  57.86,50.04 270 top
C27  66.29,50.04 270 top
C28  29.95,67.46 180 top
C29  93.65,61.32 180 bottom
C30  93.4,60.6 90 top
C31  29.29,50.16 180 bottom
CON1  90.81,85.09 0 bottom
D1  27.1,70.54 180 top
F1  25.4,79.97 180 bottom
IC1  19.68,26.04 0 bottom
IC2  19.68,57.78 0 bottom
IC3  101.32,35.48 180 top
IC4  114.1,30.71 90 bottom
IC5  33.02,59.69 180 top
IC6  54.1,53.98 180 top
IC7  62.23,53.98 180 top
IC8  70.48,53.98 180 top
J2  0,82.55 270 top
JP2  111.76,8.36 0 top
JP4  25.4,12.06 0 top
JP5  35.36,17.14 0 top
JP6  110.21,56.39 180 top
JP7  58.42,89.64 180 top
JP8  19.68,79.97 0 top
JP9  95.25,78.11 180 top
JP10  45.72,9.63 180 top
JP11  83.82,9.63 180 top
L2  52.76,69.55 90 top
R1  114.12,57.96 180 bottom
R2  94.74,48.9 0 bottom
R3  31.1,17.2 0 top
R4  36.14,23.9 180 top
R5  33.17,22.49 0 bottom
R6  35.78,25.93 180 top
R7  90.27,62.87 180 bottom
R8  114.12,54.81 180 bottom
R9  35.23,24.36 180 bottom
R10  33.17,20.02 0 bottom
R11  78.11,56.41 270 top
R12  90.27,61.32 180 bottom
R13  114.12,56.39 180 bottom
R14  34.29,12.7 180 top
R15  54.64,37.8 90 top
R16  102.01,87.02 90 top
R17  65.2,85.04 0 top
R19  66.45,74.22 0 top
R20  71.96,85.04 180 top
R21  76.07,54.2 270 top
R22  62.23,45.72 225 top
R23  63.98,43.84 225 top
RN1  26.67,15.11 180 top
U1  80.37,36.75 180 top
U$1  44.78,34.14 0 top
U$2  40.72,24.99 270 bottom
U$3  31.6,31.33 0 top
X1  11.43,25.4 270 top
X2  11.43,57.15 270 top

### Tracks (layer width: path | path; a pad name or v marks a point on that pad's centre or on a via)
5V  (via drill 0.6 pad 1.42)  (1 unrouted)
  Top 0.267: 50.01,24.11 49.28,24.86 U$1.22 49.28,36.91 50.51,38.14 U$1.46 53.55,38.14 53.86,38.45 R15.2 | U$1.70 41.28,44.08 C2.1 | R3.2 31.75,17.15 31.75,17.14 | IC7.20 66.28,50.67 C27.1 | IC6.20 57.85,50.67 C26.1
  Top 0.305: IC6.20 56.96,53.34 | 58.78,53.34 58.78,46.91 56.97,45.11 56.97,39.38 C3.1 | IC7.20 65.09,53.02 65.41,53.34 | 73.66,53.34 73.34,53.02 IC8.20 C24.1 | 50.01,24.11 C1.1 | R21.2 76.19,53.35 76.2,53.34
  Top 0.406: C14.1 U1.32 | RN1.1 31.75,15.24 31.75,17.14 31.75,20.12 34.93,23.29 34.93,24.13 | R6.2 34.93,24.13 | R4.2 35.07,24.13 34.93,24.13 | C28.1 31.17,67.46 31.32,67.31 | R15.2 C3.1
  Top 0.457: U1.32 76.91,27.23 78.11,26.04 v78.11,24.64
  Top 0.61: IC3.31 IC3.32 v100.05,24.64 99.42,24 C13.1 | v27.8,45.38 39.94,45.38 41.17,44.15 C2.1 | R14.2 31.75,15.24 | C30.+ 93.36,59.1 93.34,59.12 | U$3.4 v28.57,32.15 C15.1 | R16.2 102.01,91.21 102.23,91.44 | v78.11,53.34 R11.2
  Top 0.813: v25.65,62.69 25.65,68.83 27.3,70.48 31.32,70.48 | v78.11,53.34 76.2,53.34 73.66,53.34 65.41,53.34 58.78,53.34 56.96,53.34 v46.35,53.34
  Top 1.067: IC5.4 31.32,67.31 31.32,70.48 31.32,73.69 C20.+ | C22.+ 59.69,88.9 | 59.69,88.9 JP7.1 | 119.08,65.2 v119.08,56.39 119.08,26.8 v117.17,24.89 | 119.08,65.2 119.08,81.58 109.22,91.44 102.23,91.44 71.12,91.44 68.58,88.9 59.69,88.9 | v91.12,59.12 93.34,59.12 100.05,59.12 | 100.05,59.12 v100.05,52.07 | 119.08,65.2 102.67,65.2 100.05,62.59 100.05,59.12
  Top 1.676: C20.+ 35.13,84.66 37.02,86.55 L2.P$2 C22.+
  Bottom 0.406: CON1.13 90.49,63.93 91.12,63.93 | CON1.38 91.12,63.93 | 91.12,63.93 R7.2 | RN1.1 31.75,15.24 | C31.+
  Bottom 0.61: IC4.16 v117.17,24.89 C17.1 | R7.2 R12.2 | R12.2 v91.12,59.12 | R8.2 R13.2 | R13.2 R1.2 | 31.75,26.9 U$2.8 U$2.7 | 31.75,26.9 C6.2 24.55,26.89 24.13,27.3 IC1.16 24.13,33.66 24.14,33.64 C11.1 27.23,33.5 v28.57,32.15 | 31.75,15.24 31.75,19.68 | 31.75,19.68 31.75,19.86 | R13.2 v119.08,56.39 | v25.65,62.69 IC2.16 | 31.75,19.86 | 31.75,19.86 R5.2 31.75,26.9 | R10.2 31.77,19.71 31.75,19.68 | R14.2 RN1.1 | R12.2 C29.1
  Bottom 0.66: IC2.16 C12.1
  Bottom 0.813: v78.11,24.64 v78.11,53.34 | v100.05,24.64 v100.05,52.07 | C9.2 C31.+ v27.8,45.38 24.13,41.71 24.13,33.66 | C9.2 27.8,58.56 25.65,60.71 v25.65,62.69 | C9.2 42.75,56.95 v46.35,53.34
!BUSACK
  Top 0.267: U$1.94 35.66,31.14 32.31,27.79 32.31,24.03 24.13,15.85 RN1.4
  Top 0.61: JP4.2 RN1.4
  Bottom 0.61: JP4.2 RN1.4
!BUSREQ
  Top 0.267: U$1.95 35.97,30.64 32.87,27.53 32.87,23.77 26.67,17.58 RN1.3
  Top 0.61: JP4.3 RN1.3
  Bottom 0.61: JP4.3 RN1.3
!INT
  Top 0.267: U$1.98 38.05,29.14 38.18,29.01 38.18,27.86 37.57,27.25 37.57,24.47 R4.1 36.98,22.91 35.36,21.29 35.36,14.17 34.39,13.21 34.39,7.9 37.41,4.88 62.1,4.88 64.75,7.52 69.01,7.52 69.85,8.36 JP11.15
!IORQ
  Top 0.267: U$1.83 36.03,36.64 35.36,37.31 26.62,37.31 23.65,34.34 23.65,23.98 17.14,17.48 17.14,7.44 21.95,2.64 63.09,2.64 65.71,5.26 70.46,5.26 71.6,6.4 78.05,6.4 80.01,8.36 JP11.11
  Bottom 0.406: JP11.11 80.01,10.79 80.9,11.68 83.24,11.68 83.82,11.1 83.82,8.26 85.98,6.1 102.62,6.1 104.14,7.62 104.14,11.23 109.12,16.2 109.12,20.85 112.67,24.41 112.67,31.09 112.42,31.34 IC4.5
!IRQ1  (via drill 0.6 pad 1.42)
  Top 0.267: U$1.99 35.6,28.64 33.98,27.03 33.98,23.27 30.45,19.73 R3.1 30.45,17.17 30.48,17.14 v30.48,6.68
  Bottom 0.406: JP2.1 105.54,4.67 34.21,4.67 32.21,6.68 v30.48,6.68
!IRQ2  (via drill 0.6 pad 1.42)
  Top 0.267: U$1.100 36.63,28.14 R6.1 36.14,25.45 36.14,22.89 32.87,19.61 32.87,12.09 31.7,10.92 v31.7,5.46
  Bottom 0.406: JP2.2 109.22,8.36 109.22,6.35 106.83,3.96 33.2,3.96 v31.7,5.46
!M1  (via drill 0.6 pad 1.42)
  Top 0.267: U$1.86 36.08,35.14 34.49,36.73 26.85,36.73 24.23,34.11 24.23,23.75 18.29,17.8 v18.29,7.92
  Bottom 0.406: IC4.6 112.47,32.61 113.39,31.7 113.39,24.11 109.83,20.55 109.83,14.38 106.68,11.23 106.68,7.62 104.44,5.38 62.23,5.38 | JP11.18 62.23,5.38 | 62.23,5.38 34.52,5.38 31.98,7.92 v18.29,7.92
!NMI
  Top 0.267: U$1.97 35.78,29.64 33.43,27.28 33.43,23.52 29.21,19.3 RN1.2
  Top 0.61: JP4.4 RN1.2
  Bottom 0.61: JP4.4 RN1.2
!RAM_CS  (via drill 0.6 pad 1.42)
  Top 0.267: U$1.48 55.04,39.14 v55.83,39.93
  Top 0.305: U1.22 v69.22,39.93
  Bottom 0.406: v55.83,39.93 v69.22,39.93
!RD  (via drill 0.6 pad 1.42)
  Top 0.267: U$1.88 35.46,34.14 34.04,35.56 27.3,35.56 25.4,33.66 25.4,23.29 19.99,17.88 19.99,6.86 23.09,3.76 62.61,3.76 65.23,6.38 69.95,6.38 71.09,7.52 76.63,7.52 77.47,8.36 JP11.12
  Top 0.305: IC3.24 85.45,36.75 84.81,37.39 U1.24
  Top 0.406: U1.24 v71.86,37.39
  Bottom 0.406: JP11.12 77.47,11.84 73,16.31 73,31.55 71.86,32.69 v71.86,37.39 71.86,67.41 74.3,69.85 85.34,69.85 86.04,69.15 CON1.34
!ROM_CS  (via drill 0.6 pad 1.42)
  Top 0.267: U$1.49 54.19,39.64 54.59,40.03 v54.59,41.15
  Top 0.305: IC3.22 70.31,39.29 v69.22,38.2
  Bottom 0.406: v54.59,41.15 69.72,41.15 70.43,40.44 70.43,39.42 v69.22,38.2
!RST  (via drill 0.6 pad 1.42)
  Top 0.267: U$1.96 38.44,30.14 38.73,29.84 38.73,27.71 38.12,27.1 38.12,22.43 v36.96,21.26 37.82,20.4 37.82,15.62 34.98,12.78 34.98,8.13 37.67,5.44 61.85,5.44 64.77,8.36 JP11.17
  Top 0.406: v66.37,59.26 66.37,55.93 65.51,55.07 46.25,55.07 v41.81,50.62
  Bottom 0.406: U$2.5 39.57,23.09 39.9,23.42 39.9,48.72 v41.81,50.62 | CON1.41 94.93,70.17 93.83,71.27 73.71,71.27 70.43,68 70.43,60.12 69.57,59.26 v66.37,59.26
  Bottom 0.61: U$2.5 36.83,23.09 | 36.83,23.09 35.19,23.09 R5.1 | v36.96,21.26 36.96,22.96 36.83,23.09
!WAIT
  Top 0.267: RN1.5 21.59,15.95 22.5,16.87 24.33,16.87 31.73,24.26 31.73,28.02 35.35,31.64 U$1.93
  Top 0.61: JP4.1 RN1.5
  Bottom 0.61: JP4.1 RN1.5
!WR  (via drill 0.6 pad 1.42)
  Top 0.267: U$1.87 35.77,34.64 34.27,36.14 27.08,36.14 24.82,33.88 24.82,23.52 19.43,18.14 19.43,6.6 22.84,3.2 62.84,3.2 65.46,5.82 70.21,5.82 71.35,6.96 77.34,6.96 78.74,8.36 78.74,10.9 78.03,11.61 75.64,11.61 74.93,10.9 JP11.13
  Top 0.406: U1.29 v71.78,31.04
  Bottom 0.406: JP11.13 74.93,13.34 71.78,16.48 v71.78,31.04 70.46,32.36 70.46,38.43 71.14,39.12 71.14,67.72 73.99,70.56 85.9,70.56 87.31,69.15 CON1.35
/ACK
  Top 0.305: R21.1 68.77,55.05 68.26,55.56 IC8.9 68.26,59.32 73.18,64.24 88.8,64.24 99.01,74.45 99.01,85.65 97.66,87 74.93,87 74.02,86.08 74.02,81.92 JP9.19
/ERR  (via drill 0.6 pad 1.42)
  Top 0.305: IC8.5 70.8,58.41 74.19,61.8 89.76,61.8 102.01,74.04 v102.01,84.61 | JP9.4 93.98,78.74 95.25,80.01 v95.25,84.61
  Top 0.61: v102.01,84.61 R16.1
  Bottom 0.406: v95.25,84.61 v102.01,84.61
/ERR_OUT
  Top 0.267: U$1.32 57.17,31.14 61.47,35.43 61.47,41.33 R23.2
/INIT
  Top 0.305: JP9.6 91.44,78.74 92.71,80.01 92.71,85.14 93.34,85.78 97.16,85.78 97.79,85.14 97.79,74.93 88.32,65.46 67.18,65.46 60.64,58.91 IC7.8
/PRINTER_INIT_IN
  Top 0.267: IC7.12 60.01,46.52 58.12,44.63 58.12,36.85 55.4,34.14 U$1.38
/PSTB
  Top 0.305: IC7.9 60.01,59.14 66.93,66.06 88.09,66.06 95.25,73.23 95.25,78.74 96.52,80.01 JP9.1
/PSTB_IN
  Top 0.267: IC7.11 59.37,46.67 57.56,44.86 57.56,37.08 55.11,34.64 U$1.39
/SLIN
  Top 0.305: JP9.8 88.9,78.74 90.17,80.01 90.17,85.14 91.42,86.39 97.41,86.39 98.4,85.39 98.4,74.68 88.57,64.85 67.44,64.85 61.28,58.69 IC7.7
/SLIN_IN
  Top 0.267: IC7.13 60.64,46.37 58.67,44.4 58.67,36.6 55.71,33.64 U$1.37
A0  (via drill 0.6 pad 1.42)
  Top 0.267: U$1.2 39.28,13.53 37.34,11.58 36.3,11.58 35.56,10.85 35.56,8.36 37.92,5.99 52.25,5.99 54.61,8.36 JP10.1
  Top 0.305: JP10.1 54.61,10.9 55.85,12.14 104.9,12.14 114.71,21.95 114.71,36.78 112.19,39.29 109.3,39.29 | U1.12 89.97,41.2 91.03,42.27 95.78,42.27 99.26,38.79 104.27,38.79 104.78,39.29 IC3.12 109.3,39.29 | 109.3,39.29 109.3,42.98 106.35,45.92 v106.35,55.17
  Bottom 0.406: CON1.20 99.38,59.93 104.14,55.17 v106.35,55.17
A1  (via drill 0.6 pad 1.42)
  Top 0.267: U$1.3 39.78,13.06 38.1,11.38 38.1,7.72 39.27,6.55 50.27,6.55 52.07,8.36 JP10.2 | 97.38,39.93 U1.11
  Top 0.305: 97.38,39.93 99.29,38.02 IC3.11 v111.18,38.02 114.1,35.1 114.1,22.2 104.65,12.75 53.95,12.75 52.07,10.87 JP10.2
  Bottom 0.406: CON1.19 98.11,59.17 104.04,53.24 108.18,53.24 111.12,50.29 111.12,38.08 v111.18,38.02
A2  (via drill 0.6 pad 1.42)
  Top 0.267: U$1.4 40.28,12.14 40.64,11.79 40.64,8.36 41.88,7.11 48.28,7.11 49.53,8.36 JP10.3
  Top 0.305: U1.10 97.18,38.66 99.08,36.75 IC3.10 v109.96,36.75 113.49,33.22 113.49,22.45 104.39,13.36 51.89,13.36 49.53,11 JP10.3
  Bottom 0.406: v109.96,36.75 109.96,50.44 107.87,52.53 103.76,52.53 96.84,59.45 CON1.18
A3
  Top 0.267: U$1.5 40.78,13.32 43.18,10.92 43.18,8.36 43.87,7.67 46.18,7.67 46.99,8.48 JP10.4
  Top 0.305: U1.9 97.59,37.39 98.83,36.14 105.44,36.14 106.1,35.48 IC3.9 109.27,35.48 112.88,31.88 112.88,22.71 104.14,13.97 50.06,13.97 46.99,10.9 JP10.4
A4
  Top 0.267: U$1.6 41.28,14.7 41.94,14.05 43.81,14.05 44.45,13.41
  Top 0.305: U1.8 97.99,36.12 98.58,35.53 104.78,35.53 106.1,34.21 IC3.8 109.27,34.21 112.27,31.22 112.27,22.96 103.89,14.58 45.62,14.58 44.45,13.41
  Top 0.406: JP10.5 44.45,13.41
A5  (via drill 0.6 pad 1.42)
  Top 0.267: U$1.7 41.78,15.83 v42.42,15.19
  Top 0.305: U1.7 104.19,34.85 106.1,32.94 IC3.7 109.04,32.94 111.02,30.96 v111.02,24.59 111.02,22.58 103.63,15.19 v42.42,15.19
  Bottom 0.406: JP10.6 41.91,12.7 42.42,13.21 v42.42,15.19 | v111.02,24.59 IC4.1
A6  (via drill 0.6 pad 1.42)
  Top 0.267: U$1.8 42.28,17.77 v43.64,16.41
  Top 0.305: U1.6 103.56,33.58 105.46,31.67 IC3.6 108.58,31.67 109.27,30.99 109.27,29.23 108.69,28.65 v108.69,24.59 108.69,21.11 103.38,15.8 44.53,15.8 43.92,16.41 v43.64,16.41
  Bottom 0.406: JP10.7 39.37,11.43 41.2,13.26 41.2,15.7 41.91,16.41 v43.64,16.41 | IC4.2 109.55,27.53 108.69,26.67 v108.69,24.59
A7  (via drill 0.6 pad 1.42)
  Top 0.267: U$1.9 42.78,19.73 v44.88,17.63
  Top 0.305: U1.5 103.07,32.31 104.98,30.4 106.35,30.4 | 106.35,30.4 v106.35,24.59 106.35,21.08 101.68,16.41 46.1,16.41 v44.88,17.63 | 106.35,30.4 IC3.5
  Bottom 0.406: IC4.3 109.12,28.8 106.35,26.04 v106.35,24.59 | v44.88,17.63 41.76,17.63 40.46,16.33 40.46,14.17 36.83,10.54 JP10.8
A8  (via drill 0.6 pad 1.42)
  Top 0.267: U$1.10 43.28,21.08 47.37,16.99 100.58,16.99 v105.18,21.59 | IC3.27 103.33,32.94 105.23,31.04 108.38,31.04 108.69,30.73 108.69,29.49 107.52,28.32 v107.52,21.59
  Top 0.305: U1.27 84.81,33.58 85.45,32.94 IC3.27
  Bottom 0.406: v105.18,21.59 v107.52,21.59
A9  (via drill 0.6 pad 1.42)
  Top 0.267: U$1.11 43.78,21.4 47.62,17.55 99.42,17.55 v105.18,23.32
  Top 0.305: U1.26 84.81,34.85 85.45,34.21 IC3.26 103.81,34.21 105.72,32.31 108.81,32.31 109.88,31.24 109.88,22.71 v109.86,23.32
  Bottom 0.406: v105.18,23.32 v109.86,23.32
A10  (via drill 0.6 pad 1.42)
  Top 0.267: U$1.12 44.28,21.71 47.88,18.11 66.34,18.11 v66.93,18.69
  Top 0.305: U1.23 84.81,38.66 85.45,38.02 IC3.23
  Top 0.406: v66.93,25.76 67.94,26.77 67.94,31.19 70.46,33.71 70.46,37.9 71.22,38.66 U1.23
  Bottom 0.406: v66.93,18.69 v66.93,25.76
A11  (via drill 0.6 pad 1.42)
  Top 0.267: U$1.13 44.78,22.02 48.13,18.67 65.28,18.67 66.45,19.84 67.51,19.84 v68.66,18.69
  Top 0.305: U1.25 84.81,36.12 85.45,35.48 IC3.25
  Top 0.406: v68.66,25.76 68.66,30.89 71.86,34.09 71.86,35.71 72.26,36.12 U1.25
  Bottom 0.406: v68.66,18.69 v68.66,25.76
A12
  Top 0.267: U$1.14 45.28,22.34 48.39,19.23 65.02,19.23 66.19,20.4 68.58,20.4 70.87,18.11 98.35,18.11 105.13,24.89 IC3.4
  Top 0.305: IC3.4 105.13,29.34 103.43,31.04 U1.4
A13  (via drill 0.6 pad 1.42)
  Top 0.267: U$1.16 46.28,22.15 48.64,19.79 64.77,19.79 65.94,20.95 69.65,20.95 v70.28,20.32
  Top 0.305: U1.28 84.81,32.31 85.45,31.67 IC3.28
  Top 0.406: v70.28,29.84 70.28,31.27 71.32,32.31 U1.28
  Bottom 0.406: v70.28,29.84 v70.28,20.32
A14  (via drill 0.6 pad 1.42)
  Top 0.267: U$1.17 46.78,22.46 48.9,20.34 64.52,20.34 65.68,21.51 70.71,21.51 73.56,18.67 91.42,18.67 v92,19.25
  Top 0.305: U1.3 v91.19,29.77 91.82,30.4 IC3.29
  Bottom 0.406: v92,19.25 92,28.96 v91.19,29.77
A15  (via drill 0.6 pad 1.42)
  Top 0.267: U$1.18 47.28,22.77 49.15,20.9 64.26,20.9 65.43,22.07 70.94,22.07 73.79,19.23 85.8,19.23 v86.41,19.84
  Top 0.305: U1.31 81.99,28.5 84.89,25.6 v86.41,25.6 92.02,25.6 95.4,22.23 101.4,22.23 103.86,24.69 IC3.3
  Bottom 0.406: v86.41,25.6 v86.41,19.84
A16  (via drill 0.6 pad 1.42)
  Top 0.267: U$1.19 47.78,23.09 49.4,21.46 64.01,21.46 65.18,22.63 71.2,22.63 74.04,19.79 84.73,19.79 86.72,21.77 v89.56,21.77
  Top 0.305: IC3.2 102.59,29.57 101.73,30.43 98.53,30.43 98.15,30.05 98.15,27.18 97.69,26.72 92.66,26.72 91.44,27.94 v89.56,27.94 89.48,27.94 88.92,28.5 U1.2
  Bottom 0.406: v89.56,21.77 v89.56,27.94
A17  (via drill 0.6 pad 1.42)
  Top 0.267: U$1.20 48.28,23.4 49.66,22.02 62.94,22.02 v63.78,22.86
  Top 0.305: 97.51,29.13 IC3.30 | 97.51,28.73 IC3.30 | 97.51,28.6 IC3.30 | IC3.30 97.51,29.34 93.37,29.34 92.63,28.6 90.55,28.6 90.02,29.13 85.45,29.13 84.81,29.77 U1.30 71.86,29.77 69.83,27.74 69.83,25.27 69.14,24.59 65.25,24.59 v64.29,25.55
  Bottom 0.406: v64.29,25.55 64.29,23.65 63.78,23.14 v63.78,22.86
A18
  Top 0.267: U$1.21 48.78,23.71 49.91,22.58 61.87,22.58 63.3,24 69.39,24 70.41,25.02 70.41,27.48 72.03,29.11 83.84,29.11 85.72,27.23 U1.1
  Top 0.305: IC3.1 101.32,23.62 100.53,22.84 95.68,22.84 91.75,26.77 88.8,26.77 88.34,27.23 U1.1
BUSY
  Top 0.305: IC8.8 68.9,59.09 73.43,63.63 89.03,63.63 99.62,74.22 99.62,85.9 97.92,87.61 72.36,87.61 71.12,86.36 71.12,84.88
  Top 0.61: JP9.21 71.12,84.88 R20.2
BUSY_OUT
  Top 0.267: U$1.35 56.28,32.64 59.79,36.14 59.79,43.28 R22.2
CF_CS0
  Bottom 0.305: 109.63,33.25 115.16,33.25 115.8,33.88 IC4.10
  Bottom 0.406: CON1.7 82.87,60.64 87,56.52 98.75,56.52 103.45,51.82 107.57,51.82 108.74,50.65 108.74,34.14 109.63,33.25
CLK
  Top 0.267: U$1.89 35.15,33.64 33.78,35 27.56,35 25.96,33.4 25.96,23.04 20.55,17.63 20.55,7.11 23.34,4.32 62.36,4.32 64.97,6.93 69.7,6.93 71.12,8.36 71.12,10.9 70.48,11.53 67.94,11.53 67.31,10.9 JP11.16
CS2
  Bottom 0.305: IC4.13 118.52,30.07 119.33,29.26 119.33,21.08 114.3,16.05 114.3,8.36 JP2.5
CS3
  Bottom 0.305: JP2.6 113.03,21.16 115.27,23.39 115.27,30.81 115.8,31.34 IC4.12
CS4
  Bottom 0.305: JP2.3 111.76,8.36 111.76,20.73 114.66,23.62 114.66,31.47 115.8,32.61 IC4.11
CTS1  (via drill 0.6 pad 1.42)
  Top 0.267: U$1.63 44.78,46.02 43.18,47.62 22.2,47.62 20.24,49.58 20.24,66.47 19.53,67.18 17.65,67.18 v15.24,64.77
  Bottom 0.406: IC2.9 v15.24,64.77
CTS2  (via drill 0.6 pad 1.42)
  Top 0.267: v15.24,33.02 15.24,36.55 20.62,41.94 38.78,41.94 U$1.75
  Bottom 0.406: IC1.9 v15.24,33.02
D0  (via drill 0.6 pad 1.42)
  Top 0.267: U$1.24 50.28,25.46 50.7,25.04 62.15,25.04 63.91,26.8 v65.51,26.8
  Top 0.305: v65.51,31.8 65.51,33.5 66.75,34.75 66.75,40.82 68.33,42.39 71.4,42.39 72.11,43.1 83.22,43.1 83.86,42.47 U1.13 89.51,42.47 91.8,44.76 93.29,44.76 93.98,45.44 93.98,47.14 94.26,47.42 97.33,47.42 98.15,46.61 98.15,40.95 99.69,39.4 104.01,39.4 105.18,40.56 IC3.13 107.02,44.39 105.18,46.23 v105.18,57.63
  Bottom 0.406: v65.51,31.8 v65.51,26.8 65.51,18.39 66.42,17.48 69.77,17.48 73.66,13.59 73.66,8.08 74.22,7.52 81.81,7.52 82.55,8.26 JP11.10 | CON1.21 100.65,60.69 103.71,57.63 v105.18,57.63
D1  (via drill 0.6 pad 1.42)
  Top 0.267: U$1.25 50.78,25.85 51.03,25.6 61.87,25.6 v64.29,28.02
  Top 0.305: 64.29,34.19 v64.29,33.07 64.29,40.08 67.82,43.61 70.89,43.61 71.65,44.37 83.86,44.37 84.49,43.74 U1.14 89.05,43.74 91.59,46.28 v91.59,47.14 93.09,48.64 97.84,48.64 99.42,47.07 99.42,40.97 100.38,40.01 103.76,40.01 105.13,41.38 IC3.14 105.13,44.35 104.57,44.91 104.57,56.59 104.01,57.15 v103.99,60.1
  Bottom 0.406: JP11.9 85.09,8.26 86.54,6.81 92.46,6.81 93.98,8.33 93.98,12.7 93.22,13.46 93.22,19.76 92.71,20.27 92.71,29.97 90.6,32.08 90.6,46.15 v91.59,47.14 | v64.29,33.07 v64.29,28.02 | CON1.22 101.92,62.17 v103.99,60.1
D2  (via drill 0.6 pad 1.42)
  Top 0.267: U$1.26 58.32,28.14 59.69,26.77 v61.34,26.77
  Top 0.305: v105.73,60.1 104.56,61.27 103.5,61.27 102.82,60.58 102.82,57.48 103.86,56.44 IC3.15 103.86,41.38 103.1,40.62 101.04,40.62 100.69,40.97 100.69,47.52 98.35,49.86 89.38,49.86 v89.18,49.66 89.23,49.61 89.23,45.64 88.59,45.01 U1.15 85.13,45.01 84.49,45.64 71.2,45.64 70.38,44.83 67.31,44.83 63.07,40.59 63.07,34.24 v61.9,33.07
  Bottom 0.406: v61.34,26.77 61.34,28.52 61.9,29.08 v61.9,33.07 | JP11.8 87.63,8.03 88.14,7.52 90.7,7.52 91.44,8.26 91.44,11.58 88.34,14.68 88.34,29.08 88.85,29.59 88.85,49.33 v89.18,49.66 | CON1.23 103.19,62.64 v105.73,60.1
D3  (via drill 0.6 pad 1.42)
  Top 0.267: U$1.27 59.45,28.64 v60.1,27.99
  Top 0.305: IC3.17 101.32,47.75 98.25,50.83 88.67,50.83 87.63,49.78 v87.63,48.41 88.62,47.42 88.62,46 88.27,45.64 85.45,45.64 84.81,46.28 U1.17 70.97,46.28 70.13,45.44 67.06,45.44 62.46,40.84 62.46,35.28 60.73,33.55 v60.73,31.8
  Bottom 0.406: JP11.7 90.17,11.84 87.63,14.38 87.63,29.36 88.14,29.87 88.14,47.35 87.63,47.85 v87.63,48.41 87.63,50.42 76.52,61.53 CON1.2 | v60.73,31.8 60.73,28.98 60.1,28.35 v60.1,27.99
D4  (via drill 0.6 pad 1.42)
  Top 0.267: U$1.28 61.44,29.14 v62.56,28.02
  Top 0.305: IC3.18 100.05,47.3 98.09,49.25 91.24,49.25 v90.4,48.41 90.4,45.95 88.82,44.37 84.81,44.37 84.18,45.01 U1.18 71.42,45.01 70.64,44.22 67.56,44.22 63.68,40.34 63.68,34.11 63.09,33.53 v63.09,31.8
  Bottom 0.406: JP11.6 92.71,12.06 90.78,13.99 90.78,28.45 89.56,29.67 89.56,47.57 v90.4,48.41 90.4,50.16 89.69,50.88 88.19,50.88 77.79,61.28 CON1.3 | v63.09,31.8 63.09,28.8 62.56,28.27 v62.56,28.02
D5  (via drill 0.6 pad 1.42)
  Top 0.267: U$1.29 65.1,29.64 v66.73,28.02
  Top 0.305: IC3.19 98.78,46.84 97.59,48.03 93.75,48.03 92.81,47.09 v92.81,45.92 92.46,45.57 91.75,45.57 89.28,43.1 84.18,43.1 83.54,43.74 U1.19 71.88,43.74 71.14,43 68.07,43 65.58,40.51 v65.58,36.27
  Bottom 0.406: JP11.5 95.25,12.7 93.93,14.02 93.93,20.07 93.42,20.57 93.42,30.28 91.31,32.38 91.31,44.42 v92.81,45.92 92.81,48.77 89.99,51.59 88.49,51.59 79.06,61.02 CON1.4 | v65.58,36.27 66.6,36.27 67.94,34.92 67.94,29.23 v66.73,28.02
D6  (via drill 0.6 pad 1.42)
  Top 0.267: U$1.30 65.87,30.14 66.27,29.74 v66.73,29.74
  Top 0.305: 97.51,41.83 IC3.20 97.51,42.88 | 97.51,42.88 97.51,45.62 96.85,46.28 v95.28,46.28 | 97.51,42.88 90.78,42.88 89.74,41.83 83.54,41.83 82.91,42.47 U1.20 72.34,42.47 71.65,41.78 68.58,41.78 67.36,40.56 67.36,33.71 v66.73,33.07
  Bottom 0.406: v66.73,29.74 v66.73,33.07 | 94.74,46.35 94.74,45.14 93.75,44.15 93.75,31.98 94.84,30.89 94.84,21.18 95.35,20.68 95.35,14.86 97.79,12.42 JP11.4 | CON1.5 80.33,60.74 88.77,52.3 92.58,52.3 94.74,50.14 94.74,46.35 | v95.28,46.28 94.84,46.25 94.74,46.35
D7  (via drill 0.6 pad 1.42)
  Top 0.267: U$1.31 65.92,30.64 67.94,32.66 67.94,40.31 68.83,41.2 U1.21
  Top 0.305: U1.21 84.81,41.2 85.45,40.56 92.48,40.56 | 92.48,40.56 IC3.21 | v92.53,41.12 92.53,40.62 92.48,40.56
  Bottom 0.406: JP11.3 100.33,8.26 99.59,7.52 97.26,7.52 96.52,8.26 96.52,12.7 94.64,14.58 94.64,20.37 94.13,20.88 94.13,30.58 92.53,32.18 v92.53,41.12 92.53,43.92 94.03,45.41 94.03,48.76 R2.2
GND  (via drill 0.6 pad 1.42)
  Top 0.267: C2.2 42.78,44.01 U$1.67 42.78,40.56 | 38.24,33.14 U$1.90 32.52,33.14 31.62,34.04 | U$1.15 45.78,27.7 | U$1.41 54.23,35.64 | 72.71,51.88 72.71,52.01 72.44,52.27 71.27,52.27 71.25,52.3 | U$1.51 50.78,42.98 51.03,43.23 | U$1.50 53.7,40.14 53.75,40.18 | U$1.51 52.53,41.89 U$1.50 | U$1.51 50.78,40.14 U$1.50 | C26.2 56.47,49.39 56.32,49.53
  Top 0.305: 56.32,44.84 56.32,49.53 IC6.19 56.32,52.27 54.53,52.27 | IC7.14 61.28,49.95 61.32,49.99 | IC7.15 61.91,49.92 61.95,49.96 | IC7.16 62.55,49.97 62.56,49.99 | IC7.17 63.18,49.92 63.22,49.96 | IC7.18 63.82,49.95 63.83,49.96 | 72.71,51.88 IC8.19 72.71,49.59 72.69,49.58
  Bottom 0.406: 75.25,63.82 CON1.1 75.25,68.87 | 84.15,68.83 84.14,68.87 CON1.8 84.14,63.56 84.99,62.71 | 85.39,63.7 85.41,63.72 CON1.9 85.41,68.8 85.06,69.14 | CON1.10 86.68,63.79 | 88.16,63.12 87.95,63.34 CON1.11 87.95,69.6 87.94,69.62 | CON1.12 89.22,69.6 89.23,69.39 | 91.76,69.6 CON1.14 91.76,63.97 | 93.03,69.6 CON1.15 93.03,63.77 93.02,63.75 | 92.39,69.6 CON1.39 92.39,63.72 92.38,63.7 | 94.3,69.6 CON1.16 94.3,63.72 | 95.57,63.69 CON1.17 95.57,69.6 | 106.36,63.74 CON1.50 106.36,69.6
  other vias: 41.81,53.95 20.95,36.83 22.23,66.04 15.88,48.9 102.59,46.28 33.38,33.73 14.61,7.62 30.61,28.91 53.52,23.88 42.72,46.02 46.35,50.55 85.45,48.41 98.22,20.22 46.2,12.88 53.52,26.87 75.74,24.64 96.06,24.1 54.31,35.79 114.63,19.58 26.67,6.35 95.45,63.25 87.3,59.39 33.02,67.94 27.3,67.31 59.69,78.08 31.11,84.43 57.25,47.37 63.04,49.48 75.92,48.41 75.29,59.21 114.6,39.7 107.52,46.81 90.47,54.94 116.92,73.99 121.13,73.99 121.59,39.7 58.42,9.53 66.37,61.59 58.24,58.12
  pour Bottom (isolate 0.305, rank 2, no thermals): 0,94.61 0,0 126.36,0 126.36,94.61
  pour Top (isolate 0.305, rank 2, no thermals): 0,94.61 0,75 5,75 5,8 0,8 0,0 126.36,0 126.36,94.61
N$1
  Bottom 0.406: X2.7 10.16,57.86 12.17,55.85 15.27,55.85 16.51,54.61 IC2.7
N$2
  Bottom 0.61: IC2.1 24.13,51.22 C7.2
N$3
  Bottom 0.61: IC2.4 20.32,48.91 C8.2
N$4
  Bottom 0.61: IC2.5 19.05,50.19 18.68,49.82 C8.1
N$5
  Bottom 0.61: IC2.3 21.59,51.22 C7.1
N$6
  Bottom 0.61: IC2.2 22.86,55.88 23.93,56.95 C9.1
N$7
  Bottom 0.406: X1.7 10.16,26.14 12.27,24.03 15.34,24.03 16.51,22.86 IC1.7
N$8
  Bottom 0.406: X1.2 19.25,28.14 20.32,29.21 IC1.13
N$9
  Bottom 0.61: IC1.1 24.13,19.47 C4.2
N$10
  Bottom 0.61: IC1.4 20.32,17.31 C5.2
N$11
  Bottom 0.61: IC1.5 19.05,18.41 18.68,18.05 C5.1
N$12
  Bottom 0.61: IC1.3 21.59,19.47 C4.1
N$13
  Bottom 0.61: IC1.2 22.86,24.13 23.91,25.18 C6.1
N$14
  Bottom 0.61: IC1.6 17.78,19.05 C25.1
N$15
  Bottom 0.406: X2.2 19.25,59.89 20.32,60.96 IC2.13
N$16
  Bottom 0.406: X2.3 19.05,57.15 21.59,59.69 IC2.14
N$17
  Bottom 0.406: X2.8 10.16,55.12 12.19,53.09 15.24,53.09 IC2.8
N$18
  Bottom 0.406: X1.3 19.05,25.4 21.59,27.94 IC1.14
N$19
  Bottom 0.61: IC2.6 17.78,51.04 C10.1
N$20
  Bottom 1.422: J2.PWR JP8.1
N$21
  Bottom 0.813: B1.AC1 F1.2
N$22  (via drill 0.6 pad 1.78)
  Top 0.813: C23.1 v39.6,65.48
  Top 1.067: IC5.1 v39.6,65.48 | C21.+
  Top 1.27: v39.6,65.48 C21.+
  Bottom 0.813: B1.+ 36.14,77.52 39.6,74.07 v39.6,65.48
N$23
  Top 1.067: IC5.2 D1.C
  Top 1.676: D1.C 45.25,70.54 L2.P$1
N$24
  Bottom 0.813: J2.GND@2 23.61,74.97 B1.AC2
  Bottom 1.27: J2.GND@1 7.5,76.32 8.89,74.93 10.76,74.93 J2.GND@2
N$25
  Top 0.267: U$1.45 53.47,37.64 53.97,37.15 R15.1
N$26
  Top 0.305: IC8.1 78.09,57.28 R11.1
N$27
  Bottom 0.406: CON1.44 98.74,59.55 104.34,53.95 112.41,53.95 R8.1
N$28
  Bottom 0.406: IC1.8 15.24,21.27 12.28,21.27 10.16,23.39 X1.8
N$29
  Bottom 0.406: CON1.36 88.58,63.7 R7.1
N$30
  Bottom 0.406: CON1.46 101.28,61.07 103.5,58.85 112.38,58.85 R1.1
N$31
  Bottom 0.406: R12.1 85.37,61.32 83.5,63.18 CON1.32
N$32
  Bottom 0.61: JP6.1 R13.1
N$33
  Bottom 0.406: CON1.45 100.01,60.31 103.94,56.39 JP6.2
N$34
  Bottom 0.406: CON1.6 81.6,60.49 89.08,53.01 92.89,53.01 95.59,50.31 R2.1
N$35
  Bottom 0.61: U$2.6 R9.2
N$36
  Bottom 0.61: U$2.3 C18.1
N$37
  Bottom 0.61: U$2.1 C19.1
N$38
  Bottom 0.406: U$2.2 41.07,25.63 40.62,25.17 40.62,22.84 37.8,20.02 36.63,20.02 | R10.1 36.63,20.02 | 36.63,20.02 JP5.2
N$39
  Bottom 0.813: JP8.2 F1.1
N$40  (via drill 0.6 pad 1.27)
  other vias: 5,5
N$41  (via drill 0.6 pad 1.27)
  other vias: 121.36,5
N$42  (via drill 0.6 pad 1.27)
  other vias: 5,89.61
N$43  (via drill 0.6 pad 1.27)
  other vias: 121.36,89.61
N$46
  Top 0.267: R22.1 64.21,47.7 67.46,47.7 68.26,48.5 IC8.12
N$47
  Top 0.267: IC8.15 70.17,47.97 68.22,46.02 66.17,46.02 R23.1
OSC_IN
  Top 0.267: U$1.92 32.66,32.14 U$3.3
PD0
  Top 0.305: IC6.2 56.32,58.23 64.77,66.67 85.93,66.67 92.71,73.46 92.71,78.74 93.98,80.01 JP9.3
PD0_IN
  Top 0.267: U$1.52 50.28,43.3 50.8,43.81 52.78,43.81 55.69,46.72 IC6.18
PD1
  Top 0.305: IC6.3 55.69,58.46 64.54,67.31 82.78,67.31 90.17,74.7 90.17,78.74 91.44,80.01 JP9.5
PD1_IN
  Top 0.267: U$1.53 49.78,43.61 50.55,44.37 52.53,44.37 55.05,46.9 IC6.17
PD2
  Top 0.305: IC6.4 55.05,58.69 64.31,67.94 82.55,67.94 87.63,73.03 87.63,78.74 88.9,80.01 JP9.7
PD2_IN
  Top 0.267: U$1.54 49.28,43.92 50.29,44.93 52.27,44.93 54.42,47.08 IC6.16
PD3
  Top 0.305: IC6.5 54.42,58.91 64.08,68.58 80.64,68.58 85.09,73.03 85.09,78.74 86.36,80.01 JP9.9
PD3_IN
  Top 0.267: U$1.55 48.78,44.23 50.04,45.49 52.02,45.49 53.78,47.26 IC6.15
PD4
  Top 0.305: IC6.6 53.78,59.14 63.86,69.22 78.74,69.22 82.55,73.03 82.55,78.74 83.82,80.01 JP9.11
PD4_IN
  Top 0.267: U$1.56 48.28,44.55 49.78,46.05 51.77,46.05 53.15,47.43 IC6.14
PD5
  Top 0.305: IC6.7 53.15,59.37 63.63,69.85 76.83,69.85 80.01,73.03 80.01,78.74 81.28,80.01 JP9.13
PD5_IN
  Top 0.267: U$1.57 47.78,44.86 49.53,46.61 51.51,46.61 52.51,47.61 IC6.13
PD6
  Top 0.305: IC6.8 52.51,59.58 63.4,70.46 74.95,70.46 77.47,72.97 77.47,78.74 78.74,80.01 JP9.15
PD6_IN
  Top 0.267: U$1.58 47.28,45.17 49.28,47.17 51.26,47.17 51.88,47.79 IC6.12
PD7
  Top 0.305: IC6.9 51.88,59.8 63.14,71.07 73.05,71.07 74.93,72.95 74.93,78.74 76.2,80.01 JP9.17
PD7_IN
  Top 0.267: U$1.59 46.78,45.46 49.05,47.73 51,47.73 51.24,47.97 IC6.11
PE
  Top 0.305: IC8.7 69.53,58.86 73.69,63.02 89.26,63.02 100.23,73.99 100.23,86.16 98.17,88.21 72.11,88.21 68.58,84.68 JP9.23 68.58,80.01 67.31,78.74 67.31,74.23 R19.2
PE_OUT
  Top 0.267: U$1.34 56.57,32.14 60.35,35.92 60.35,42.42 65.08,47.14 67.72,47.14 68.9,48.32 IC8.13
PR_ACK_OUT
  Top 0.267: U$1.36 56,33.14 59.23,36.37 59.23,44.15 63.35,48.26 67.21,48.26 67.63,48.68 IC8.11
RTS1  (via drill 0.6 pad 1.42)
  Top 0.267: v16.51,67.77 19.76,67.77 20.8,66.73 20.8,49.84 22.45,48.18 43.43,48.18 45.28,46.34 U$1.62
  Bottom 0.406: IC2.10 v16.51,67.77
RTS2  (via drill 0.6 pad 1.42)
  Top 0.267: v16.51,34.29 16.51,37.01 20.85,41.35 37.57,41.35 40.28,38.64 U$1.47
  Bottom 0.406: IC1.10 v16.51,34.29
RXD1  (via drill 0.6 pad 1.42)
  Top 0.267: U$1.71 40.78,42.84 39.4,44.22 22,44.22 19.68,46.53 19.68,61.59
  Top 0.305: v19.05,66.04 19.05,62.23 19.68,61.59
  Bottom 0.406: IC2.12 v19.05,66.04
RXD2  (via drill 0.6 pad 1.42)
  Top 0.267: 19.05,34.47 v19.05,34.29 19.05,37.92 20.27,39.14 U$1.78
  Bottom 0.406: IC1.12 v19.05,34.29
SLCT
  Top 0.305: IC8.6 70.17,58.63 73.94,62.41 89.51,62.41 100.84,73.74 100.84,86.41 98.42,88.82 71.86,88.82 68.07,85.04 R17.2
  Top 0.61: JP9.25 66.04,85.03 R17.2
SLCT_OUT
  Top 0.267: U$1.33 56.88,31.64 60.91,35.66 60.91,42.19 65.3,46.58 67.97,46.58 69.53,48.15 IC8.14
ST
  Top 0.267: U$1.1 38.78,14.65 R14.1
TXD1  (via drill 0.6 pad 1.42)
  Top 0.267: U$1.73 39.78,42.95 | 19.05,60.96 19.05,46.35 21.74,43.66 39.06,43.66
  Top 0.305: 39.78,42.95 39.06,43.66 | 19.05,60.96 17.78,62.23 v17.78,64.77
  Bottom 0.406: IC2.11 v17.78,64.77
TXD2  (via drill 0.6 pad 1.42)
  Top 0.267: v17.78,33.02 17.78,37.47 20.45,40.14 U$1.76
  Bottom 0.406: IC1.11 v17.78,33.02